# Altium project PPC_notebook_electrical_schematics_v0.6.PrjPcb (part 4 of 10)

## Sheet 12 Proc Pwr2.SchDoc
size 420 x 297 mm
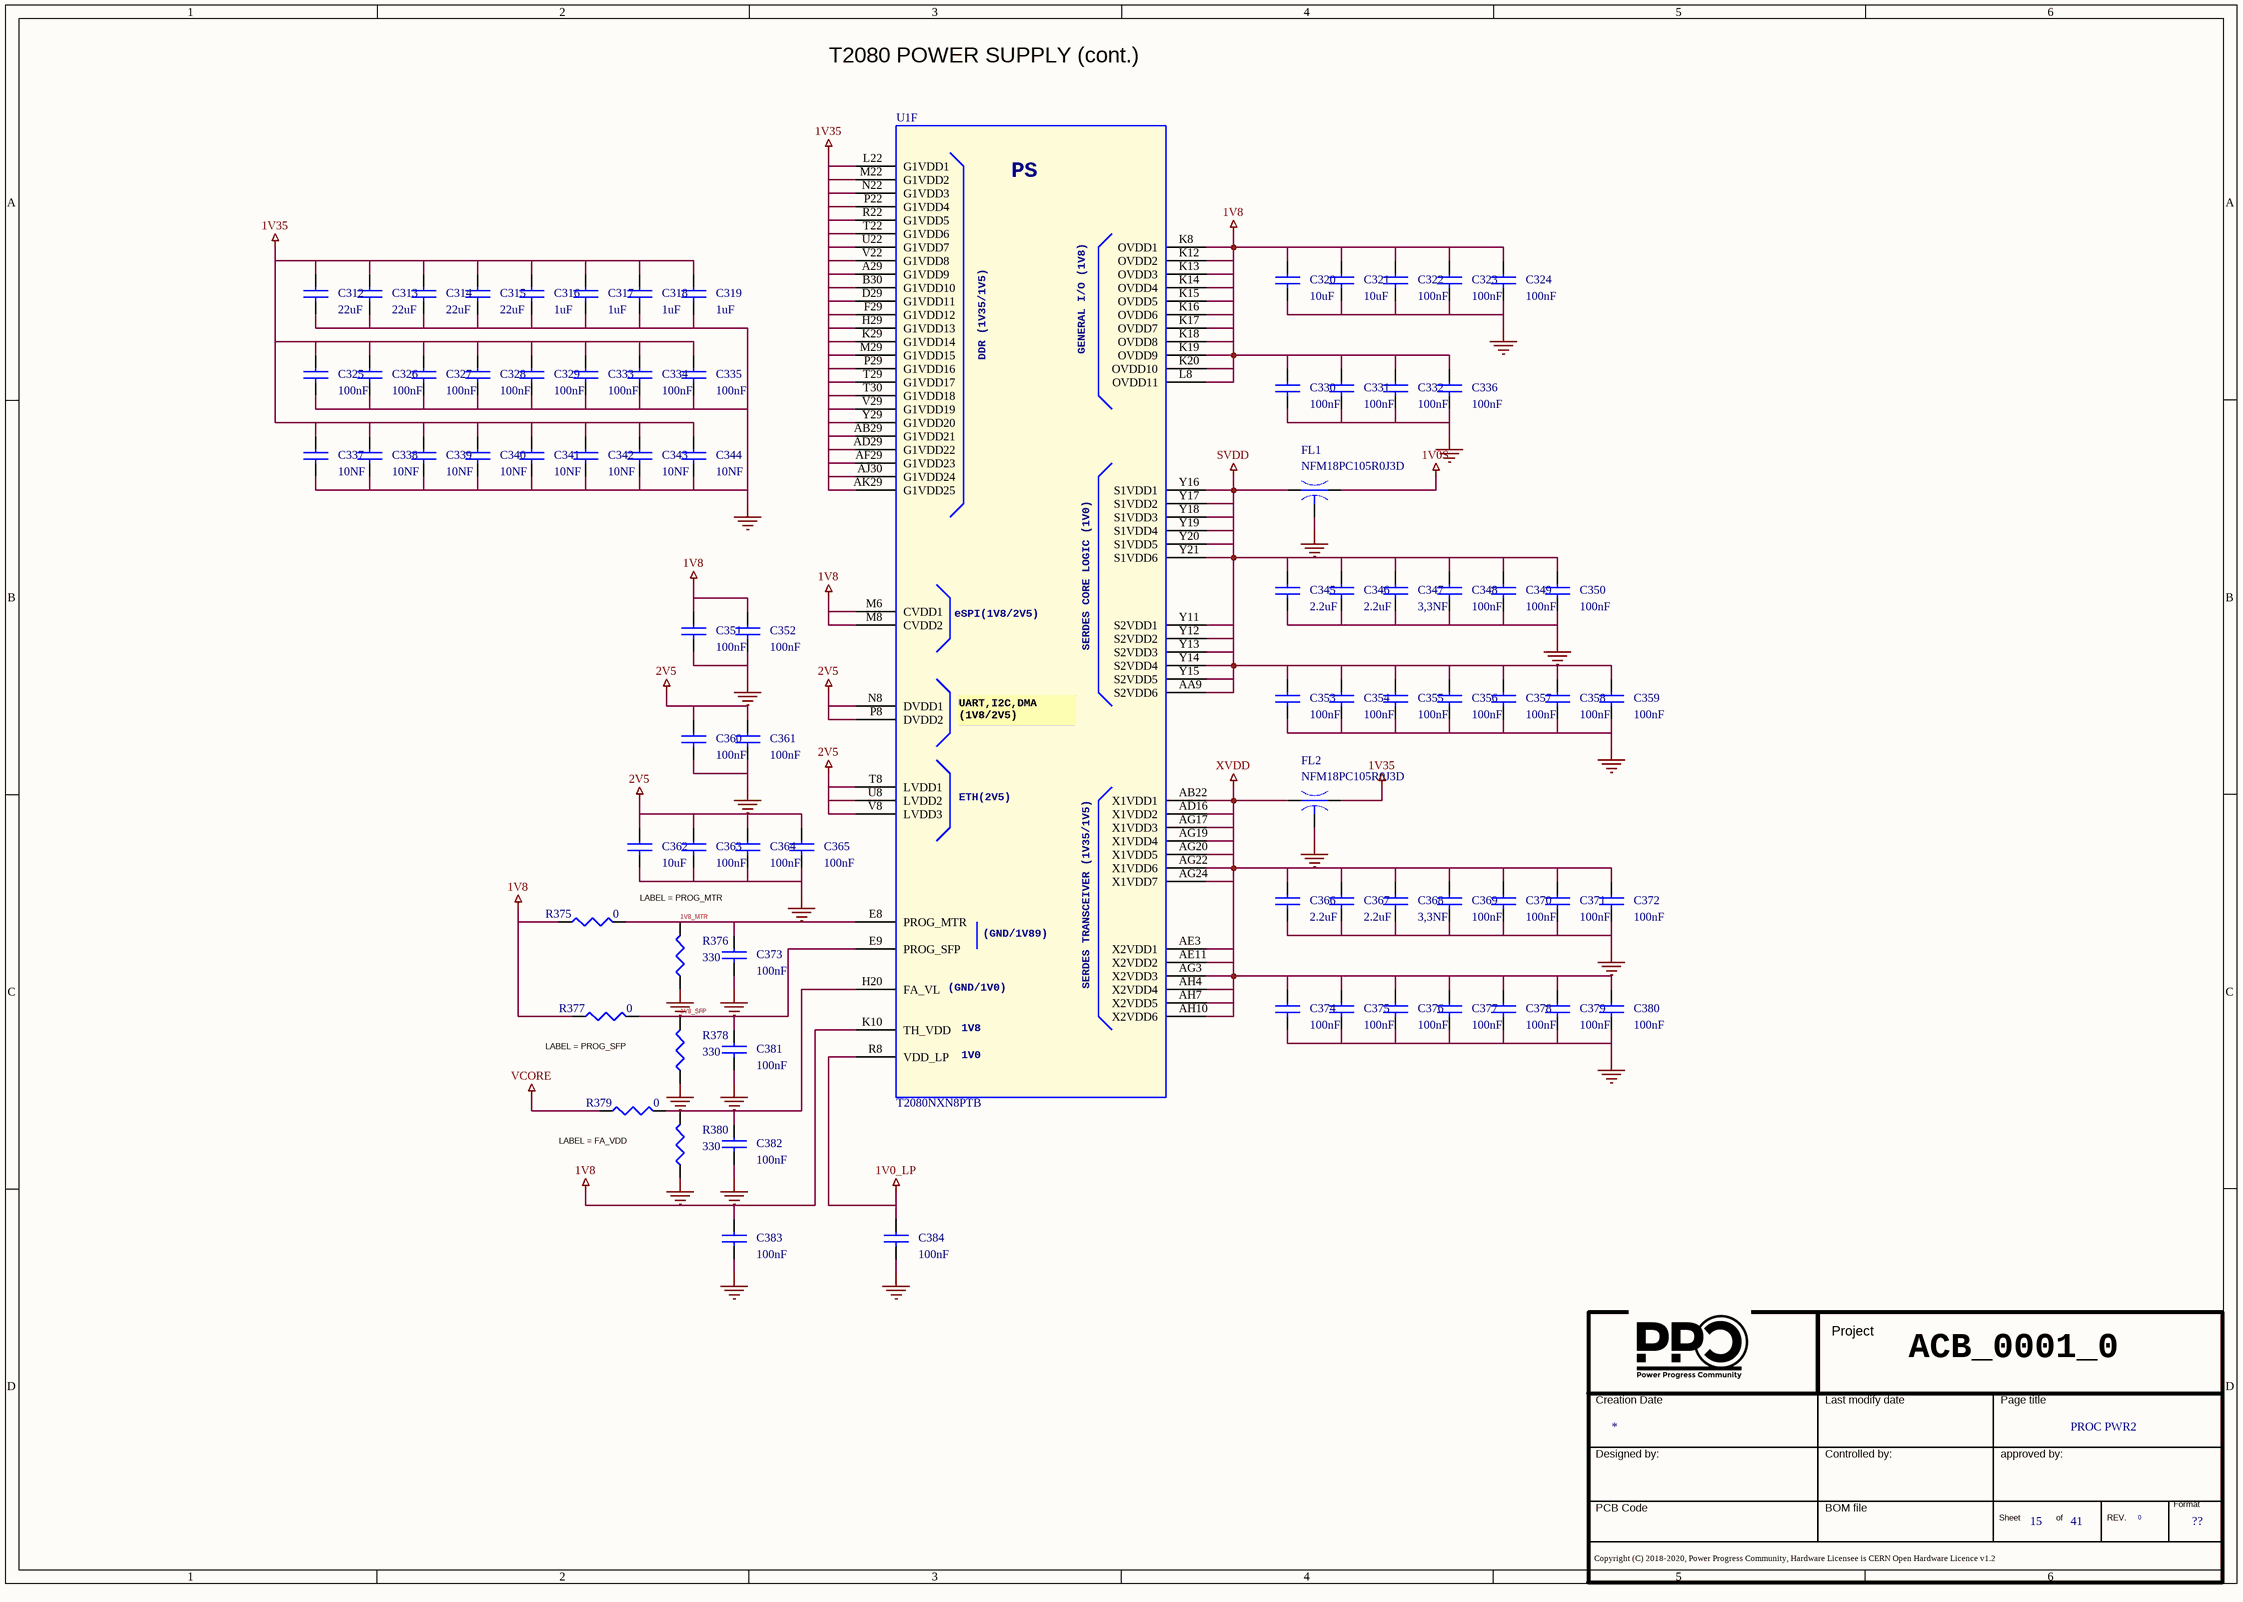
[diagram p24: 12 Proc Pwr2.SchDoc]

### Parts
(Parts that share a designator on the sheet are numbered #1, #2 ... from top to bottom, then left to right.)
*#17  Doc: PROC PWR2  Page Count: 41  Page Number: 15  Page Size: ??  RevCode: 0  (hidden comment: Title_block_PPC)  (graphical)
C312  22uF  [SMD_0805]
C313  22uF  [SMD_0805]
C314  22uF  [SMD_0805]
C315  22uF  [SMD_0805]
C316  1uF  [SMD_0402]
C317  1uF  [SMD_0402]
C318  1uF  [SMD_0402]
C319  1uF  [SMD_0402]
C320  10uF  [SMD_0603]
C321  10uF  [SMD_0603]
C322  100nF  [SMD_0201]
C323  100nF  [SMD_0201]
C324  100nF  [SMD_0201]
C325  100nF  [SMD_0201]
C326  100nF  [SMD_0201]
C327  100nF  [SMD_0201]
C328  100nF  [SMD_0201]
C329  100nF  [SMD_0201]
C330  100nF  [SMD_0201]
C331  100nF  [SMD_0201]
C332  100nF  [SMD_0201]
C333  100nF  [SMD_0201]
C334  100nF  [SMD_0201]
C335  100nF  [SMD_0201]
C336  100nF  [SMD_0201]
C337  10NF  [SMD_0402]
C338  10NF  [SMD_0402]
C339  10NF  [SMD_0402]
C340  10NF  [SMD_0402]
C341  10NF  [SMD_0402]
C342  10NF  [SMD_0402]
C343  10NF  [SMD_0402]
C344  10NF  [SMD_0402]
C345  2.2uF  [SMD_0402]
C346  2.2uF  [SMD_0402]
C347  3,3NF  [SMD_0402]
C348  100nF  [SMD_0201]
C349  100nF  [SMD_0201]
C350  100nF  [SMD_0201]
C351  100nF  [SMD_0201]
C352  100nF  [SMD_0201]
C353  100nF  [SMD_0201]
C354  100nF  [SMD_0201]
C355  100nF  [SMD_0201]
C356  100nF  [SMD_0201]
C357  100nF  [SMD_0201]
C358  100nF  [SMD_0201]
C359  100nF  [SMD_0201]
C360  100nF  [SMD_0201]
C361  100nF  [SMD_0201]
C362  10uF  [SMD_0603]
C363  100nF  [SMD_0201]
C364  100nF  [SMD_0201]
C365  100nF  [SMD_0402]
C366  2.2uF  [SMD_0402]
C367  2.2uF  [SMD_0402]
C368  3,3NF  [SMD_0402]
C369  100nF  [SMD_0201]
C370  100nF  [SMD_0201]
C371  100nF  [SMD_0201]
C372  100nF  [SMD_0201]
C373  100nF  [SMD_0201]
C374  100nF  [SMD_0201]
C375  100nF  [SMD_0201]
C376  100nF  [SMD_0201]
C377  100nF  [SMD_0201]
C378  100nF  [SMD_0201]
C379  100nF  [SMD_0201]
C380  100nF  [SMD_0201]
C381  100nF  [SMD_0201]
C382  100nF  [SMD_0402]
C383  100nF  [SMD_0201]
C384  100nF  [SMD_0201]
FL1  NFM18PC105R0J3D  [SMD_0603]
FL2  NFM18PC105R0J3D  [SMD_0603]
R375  0  [SMD_1206]
R376  330  [SMD_0402]
R377  0  [SMD_1206]
R378  330  [SMD_0402]
R379  0  [SMD_1206]
R380  330  [SMD_0402]
U1  T2080NXN8PTB  [bga]  (part F of 14)

### Nets
1V0_LP: C384.1 U1.R8(VDD_LP)
1V0S: FL1.1(IN)
1V8: C320.1 C321.1 C322.1 C323.1 C324.1 C330.1 C331.1 C332.1 C336.1 C351.1 C352.1 C383.1 R375.1 R377.1 U1.K8(OVDD1) U1.K10(TH_VDD) U1.K12(OVDD2) U1.K13(OVDD3) U1.K14(OVDD4) U1.K15(OVDD5) U1.K16(OVDD6) U1.K17(OVDD7) U1.K18(OVDD8) U1.K19(OVDD9) U1.K20(OVDD10) U1.L8(OVDD11) U1.M6(CVDD1) U1.M8(CVDD2)
1V35: C312.1 C313.1 C314.1 C315.1 C316.1 C317.1 C318.1 C319.1 C325.1 C326.1 C327.1 C328.1 C329.1 C333.1 C334.1 C335.1 C337.1 C338.1 C339.1 C340.1 C341.1 C342.1 C343.1 C344.1 FL2.1(IN) U1.A29(G1VDD9) U1.AB29(G1VDD21) U1.AD29(G1VDD22) U1.AF29(G1VDD23) U1.AJ30(G1VDD24) U1.AK29(G1VDD25) U1.B30(G1VDD10) U1.D29(G1VDD11) U1.F29(G1VDD12) U1.H29(G1VDD13) U1.K29(G1VDD14) U1.L22(G1VDD1) U1.M22(G1VDD2) U1.M29(G1VDD15) U1.N22(G1VDD3) U1.P22(G1VDD4) U1.P29(G1VDD16) U1.R22(G1VDD5) U1.T22(G1VDD6) U1.T29(G1VDD17) U1.T30(G1VDD18) U1.U22(G1VDD7) U1.V22(G1VDD8) U1.V29(G1VDD19) U1.Y29(G1VDD20)
2V5: C360.1 C361.1 C362.1 C363.1 C364.1 C365.1 U1.N8(DVDD1) U1.P8(DVDD2) U1.T8(LVDD1) U1.U8(LVDD2) U1.V8(LVDD3)
GND: C312.2 C313.2 C314.2 C315.2 C316.2 C317.2 C318.2 C319.2 C320.2 C321.2 C322.2 C323.2 C324.2 C325.2 C326.2 C327.2 C328.2 C329.2 C330.2 C331.2 C332.2 C333.2 C334.2 C335.2 C336.2 C337.2 C338.2 C339.2 C340.2 C341.2 C342.2 C343.2 C344.2 C345.2 C346.2 C347.2 C348.2 C349.2 C350.2 C351.2 C352.2 C353.2 C354.2 C355.2 C356.2 C357.2 C358.2 C359.2 C360.2 C361.2 C362.2 C363.2 C364.2 C365.2 C366.2 C367.2 C368.2 C369.2 C370.2 C371.2 C372.2 C373.2 C374.2 C375.2 C376.2 C377.2 C378.2 C379.2 C380.2 C381.2 C382.2 C383.2 C384.2 FL1.2(GND) FL2.2(GND) R376.1 R378.1 R380.1
SVDD: C345.1 C346.1 C347.1 C348.1 C349.1 C350.1 C353.1 C354.1 C355.1 C356.1 C357.1 C358.1 C359.1 FL1.3(OUT) U1.AA9(S2VDD6) U1.Y11(S2VDD1) U1.Y12(S2VDD2) U1.Y13(S2VDD3) U1.Y14(S2VDD4) U1.Y15(S2VDD5) U1.Y16(S1VDD1) U1.Y17(S1VDD2) U1.Y18(S1VDD3) U1.Y19(S1VDD4) U1.Y20(S1VDD5) U1.Y21(S1VDD6)
VCORE: R379.1
XVDD: C366.1 C367.1 C368.1 C369.1 C370.1 C371.1 C372.1 C374.1 C375.1 C376.1 C377.1 C378.1 C379.1 C380.1 FL2.3(OUT) U1.AB22(X1VDD1) U1.AD16(X1VDD2) U1.AE3(X2VDD1) U1.AE11(X2VDD2) U1.AG3(X2VDD3) U1.AG17(X1VDD3) U1.AG19(X1VDD4) U1.AG20(X1VDD5) U1.AG22(X1VDD6) U1.AG24(X1VDD7) U1.AH4(X2VDD4) U1.AH7(X2VDD5) U1.AH10(X2VDD6)
1V8_MTR: C373.1 R375.2 R376.2 U1.E8(PROG_MTR)
1V8_SFP: C381.1 R377.2 R378.2 U1.E9(PROG_SFP)
NetC382_1: C382.1 R379.2 R380.2 U1.H20(FA_VL)

### Notes on the sheet
- T2080 POWER SUPPLY (cont.)
- LABEL = PROG_MTR
- (near R377) LABEL = PROG_SFP
- (near R379) LABEL = FA_VDD
- ACB_0001_0
- (in symbol T2080, part F) PS; GENERAL I/O (1V8); DDR (1V35/1V5); eSPI(1V8/2V5); SERDES CORE LOGIC (1V0); UART,I2C,DMA / (1V8/2V5); ETH(2V5); (GND/1V89); SERDES TRANSCEIVER (1V35/1V5); (GND/1V0); 1V8; 1V0

### Library data of the parts
*#17 = Title_block_PPC: Title: T2080PCIe; Schematic Page Count: 45; Schematic Page Number: 17; Author: MICETEK; Page Create Date: March  8, 1995; Page Title: ?; Page Modify Date: *
C312-C315 = CAP NP_Dup2: as C192-C203 on sheet 11 Proc Pwr1; PCB Footprint: SMD_0805; Part Type: Capacitors\Ceramic\SMD\0805
C316-C319 = CAP NP_Dup2: as C204-C207 on sheet 11 Proc Pwr1; PCB Footprint: SMD_0402; Part Type: Capacitors\Ceramic\SMD\0402
C320 C321 C362 = CAP NP_Dup2: COND.CER.10uF 0603 25V SMD; Manufacturer Part Number 1: CL10A106MA8NRNC; Manufacturer 1: SAMSUNG; Part Number: PASSIVE_124; RSM: RC0603; PCB Footprint: SMD_0603; Part Type: Capacitors\Ceramic\SMD\0603
C322-C336 C348-C361 C363 C364 C369-C381 C383 C384 = CAP NP_Dup2: CAP CER 0.1UF 6.3V 20% X5R 0201; Manufacturer Part Number 1: C0603X5R0J104M030BC; Manufacturer 1: TDK; Part Number: PASSIVE_3; RSM: RC0201; PCB Footprint: SMD_0201; Part Type: Capacitors\Ceramic\SMD\0201
C337-C344 = CAP NP_Dup2: COND.CER. 10NF 16V 0402 X7R SMD; Manufacturer Part Number 1: 0402YC103KAT2A; Manufacturer 1: AVX; Part Number: PASSIVE_28; RSM: RC0402; PCB Footprint: SMD_0402; Part Type: Capacitors\Ceramic\SMD\0402
C345 C346 C366 C367 = CAP NP_Dup2: CAP CER 2.2UF 25V X5R 0402; Manufacturer Part Number 1: GRM155R61E225ME15D; Manufacturer 1: Murata; Part Number: PASSIVE_1448; RSM: RC0402; PCB Footprint: SMD_0402; Part Type: Capacitors\Ceramic\SMD\0402
C347 C368 = CAP NP_Dup2: COND.CER. 3,3NF 50V 0402 X7R SMD; Part Number: PASSIVE_69; RSM: RC0402; PCB Footprint: SMD_0402; Part Type: Capacitors\Ceramic\SMD\0402
C365 C382 = CAP NP_Dup2: as C153-C155 on sheet 10 UART&I2C; PCB Footprint: SMD_0402; Part Type: Capacitors\Ceramic\SMD\0402
FL1 = CAP_EMI_FIL: FILTER LC HIGH FREQ 1UF 0603; Manufacturer 1: Murata; Part Number: PASSIVE_348; RSM: EMI-NFM18-0603; Manufacturer Part Number 1: NFM18PC105R0J3D; Part Type: FILTER\CAP_FIL; PCB Footprint: SMD_0603
FL2 = CAP_EMI_FIL: FILTER LC HIGH FREQ 1UF 0603; Part Number: PASSIVE_348; Manufacturer 1: Murata; RSM: EMI-NFM18-0603; Part Type: FILTER\CAP_FIL; Manufacturer Part Number 1: NFM18PC105R0J3D; PCB Footprint: SMD_0603
R375 R377 R379 = R_Dup5: RESIS. 0R 1/4W 1206 SMD E96; Manufacturer Part Number 1: CR32000ZL; Manufacturer 1: ASJ; Part Number: PASSIVE_1266; RSM: RC1206; Part Type: Resistors\Fixed\SMD\1206\5%; PCB Footprint: SMD_1206
R376 R378 R380 = R_Dup5: RESIS.CHIP 330R 5% 0402 SMD; Part Number: PASSIVE_854; Manufacturer 1: ROYAL OHM; RSM: RC0402; Part Type: Resistors\Fixed\SMD\0402\5%; Manufacturer Part Number 1: RESIS.CHIP 330R 5% 0402 SMD; PCB Footprint: SMD_0402
U1 = T2080: QRIQ MPU 1.87GT/s DDR3/3L 4x10GE; Part Number: MICROPROCESSOR_65; Manufacturer 1: NXP; Vendor: Freescale; PCB Footprint: BGA896; RSM: PBGA896-0_8MM-25X25; MPN: T2080; TYPE: IC; Part Type: 32 BIT; Manufacturer Part Number 1: T2080NXN8PTB; Distributor 1: MOUSER(841-T2080NXN8PTB)

## Sheet 13 Proc Gnd.SchDoc
size 420 x 297 mm
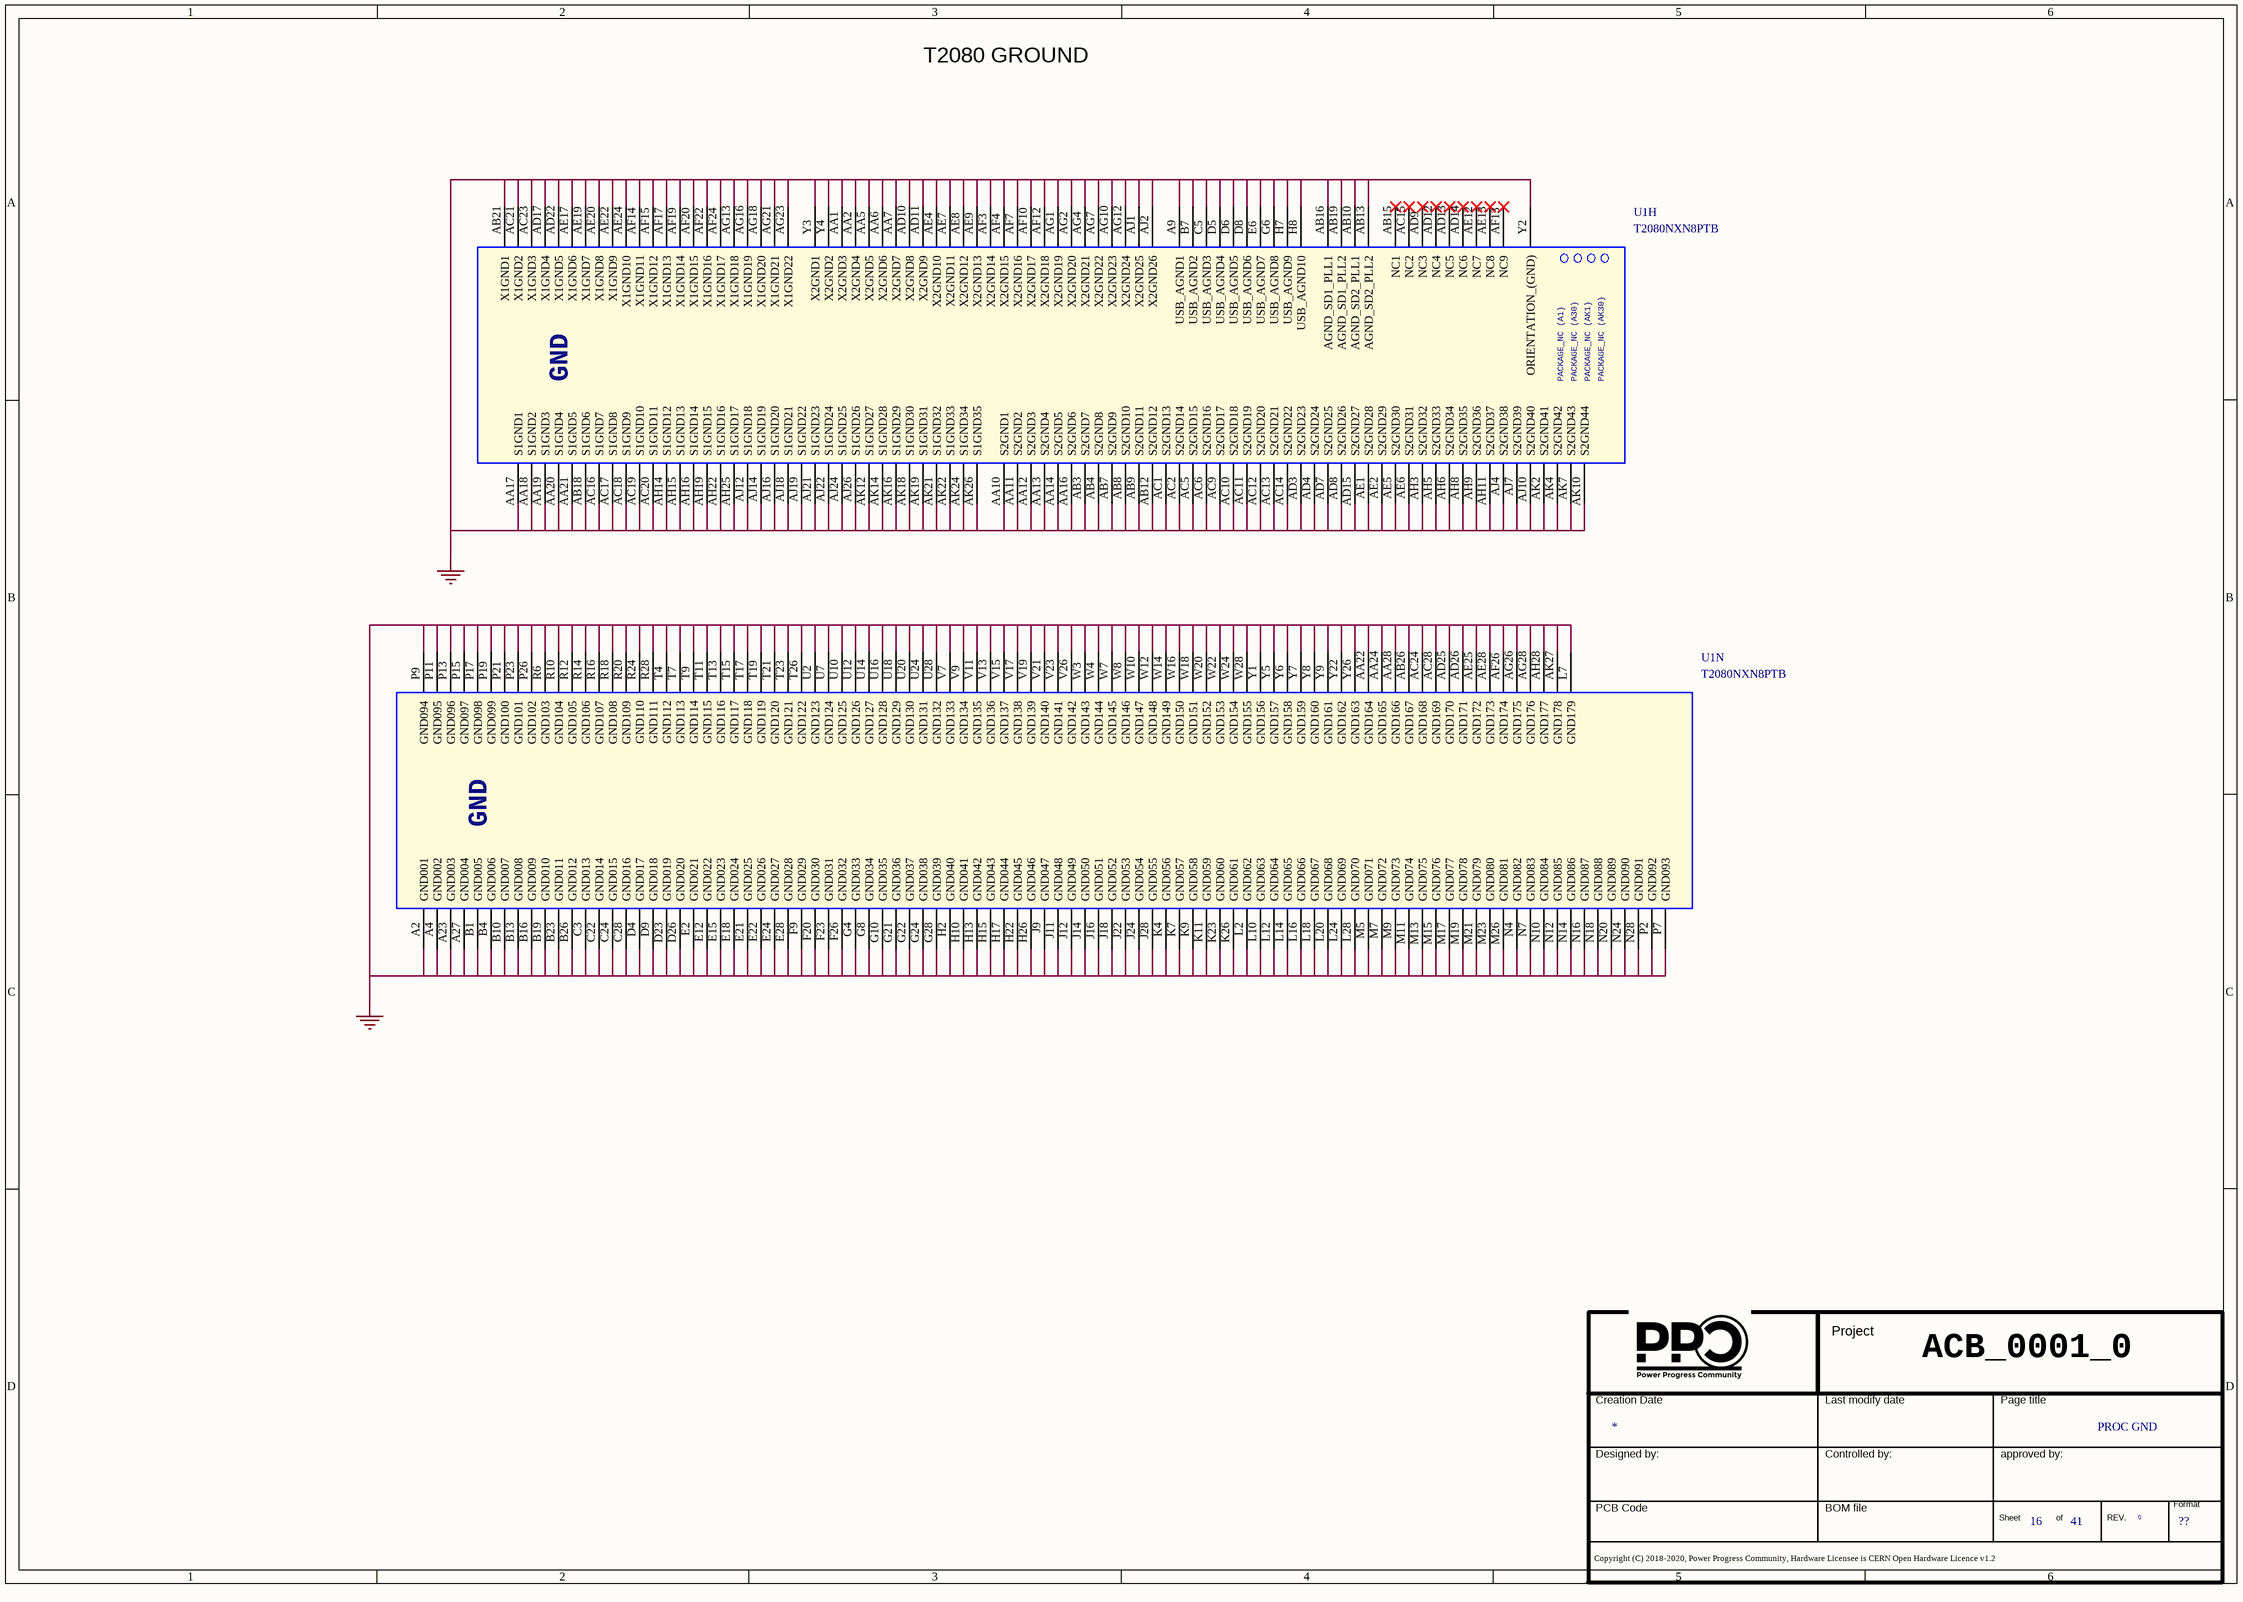
[diagram p25: 13 Proc Gnd.SchDoc]

### Parts
(Parts that share a designator on the sheet are numbered #1, #2 ... from top to bottom, then left to right.)
*#18  Doc: PROC GND  Page Count: 41  Page Number: 16  Page Size: ??  RevCode: 0  (hidden comment: Title_block_PPC)  (graphical)
U1  T2080NXN8PTB  [bga]  (parts H,N of 14)

### Nets
GND: U1.A2(GND001) U1.A4(GND002) U1.A9(USB_AGND1) U1.A23(GND003) U1.A27(GND004) U1.AA1(X2GND3) U1.AA2(X2GND4) U1.AA5(X2GND5) U1.AA6(X2GND6) U1.AA7(X2GND7) U1.AA10(S2GND1) U1.AA11(S2GND2) U1.AA12(S2GND3) U1.AA13(S2GND4) U1.AA14(S2GND5) U1.AA16(S2GND6) U1.AA17(S1GND1) U1.AA18(S1GND2) U1.AA19(S1GND3) U1.AA20(S1GND4) U1.AA21(S1GND5) U1.AA22(GND164) U1.AA24(GND165) U1.AA28(GND166) U1.AB3(S2GND7) U1.AB4(S2GND8) U1.AB7(S2GND9) U1.AB8(S2GND10) U1.AB9(S2GND11) U1.AB10(AGND_SD2_PLL1) U1.AB12(S2GND12) U1.AB13(AGND_SD2_PLL2) U1.AB16(AGND_SD1_PLL1) U1.AB18(S1GND6) U1.AB19(AGND_SD1_PLL2) U1.AB21(X1GND1) U1.AB26(GND167) U1.AC1(S2GND13) U1.AC2(S2GND14) U1.AC5(S2GND15) U1.AC6(S2GND16) U1.AC9(S2GND17) U1.AC10(S2GND18) U1.AC11(S2GND19) U1.AC12(S2GND20) U1.AC13(S2GND21) U1.AC14(S2GND22) U1.AC16(S1GND7) U1.AC17(S1GND8) U1.AC18(S1GND9) U1.AC19(S1GND10) U1.AC20(S1GND11) U1.AC21(X1GND2) U1.AC23(X1GND3) U1.AC24(GND168) U1.AC28(GND169) U1.AD3(S2GND23) U1.AD4(S2GND24) U1.AD7(S2GND25) U1.AD8(S2GND26) U1.AD10(X2GND8) U1.AD11(X2GND9) U1.AD15(S2GND27) U1.AD17(X1GND4) U1.AD22(X1GND5) U1.AD25(GND170) U1.AD26(GND171) U1.AE1(S2GND28) U1.AE2(S2GND29) U1.AE4(X2GND10) U1.AE5(S2GND30) U1.AE6(S2GND31) U1.AE7(X2GND11) U1.AE8(X2GND12) U1.AE9(X2GND13) U1.AE17(X1GND6) U1.AE19(X1GND7) U1.AE20(X1GND8) U1.AE22(X1GND9) U1.AE24(X1GND10) U1.AE25(GND172) U1.AE28(GND173) U1.AF3(X2GND14) U1.AF4(X2GND15) U1.AF7(X2GND16) U1.AF10(X2GND17) U1.AF12(X2GND18) U1.AF14(X1GND11) U1.AF15(X1GND12) U1.AF17(X1GND13) U1.AF19(X1GND14) U1.AF20(X1GND15) U1.AF22(X1GND16) U1.AF24(X1GND17) U1.AF26(GND174) U1.AG1(X2GND19) U1.AG2(X2GND20) U1.AG4(X2GND21) U1.AG7(X2GND22) U1.AG10(X2GND23) U1.AG12(X2GND24) U1.AG13(X1GND18) U1.AG16(X1GND19) U1.AG18(X1GND20) U1.AG21(X1GND21) U1.AG23(X1GND22) U1.AG26(GND175) U1.AG28(GND176) U1.AH3(S2GND32) U1.AH5(S2GND33) U1.AH6(S2GND34) U1.AH8(S2GND35) U1.AH9(S2GND36) U1.AH11(S2GND37) U1.AH14(S1GND12) U1.AH15(S1GND13) U1.AH16(S1GND14) U1.AH19(S1GND15) U1.AH22(S1GND16) U1.AH25(S1GND17) U1.AH28(GND177) U1.AJ1(X2GND25) U1.AJ2(X2GND26) U1.AJ4(S2GND38) U1.AJ7(S2GND39) U1.AJ10(S2GND40) U1.AJ12(S1GND18) U1.AJ14(S1GND19) U1.AJ16(S1GND20) U1.AJ18(S1GND21) U1.AJ19(S1GND22) U1.AJ21(S1GND23) U1.AJ22(S1GND24) U1.AJ24(S1GND25) U1.AJ26(S1GND26) U1.AK2(S2GND41) U1.AK4(S2GND42) U1.AK7(S2GND43) U1.AK10(S2GND44) U1.AK12(S1GND27) U1.AK14(S1GND28) U1.AK16(S1GND29) U1.AK18(S1GND30) U1.AK19(S1GND31) U1.AK21(S1GND32) U1.AK22(S1GND33) U1.AK24(S1GND34) U1.AK26(S1GND35) U1.AK27(GND178) U1.B1(GND005) U1.B4(GND006) U1.B7(USB_AGND2) U1.B10(GND007) U1.B13(GND008) U1.B16(GND009) U1.B19(GND010) U1.B23(GND011) U1.B26(GND012) U1.C3(GND013) U1.C5(USB_AGND3) U1.C22(GND014) U1.C24(GND015) U1.C28(GND016) U1.D4(GND017) U1.D5(USB_AGND4) U1.D6(USB_AGND5) U1.D8(USB_AGND6) U1.D9(GND018) U1.D23(GND019) U1.D26(GND020) U1.E2(GND021) U1.E6(USB_AGND7) U1.E12(GND022) U1.E15(GND023) U1.E18(GND024) U1.E21(GND025) U1.E22(GND026) U1.E24(GND027) U1.E28(GND028) U1.F9(GND029) U1.F20(GND030) U1.F23(GND031) U1.F26(GND032) U1.G4(GND033) U1.G6(USB_AGND8) U1.G8(GND034) U1.G10(GND035) U1.G21(GND036) U1.G22(GND037) U1.G24(GND038) U1.G28(GND039) U1.H2(GND040) U1.H7(USB_AGND9) U1.H8(USB_AGND10) U1.H10(GND041) U1.H13(GND042) U1.H15(GND043) U1.H17(GND044) U1.H22(GND045) U1.H26(GND046) U1.J9(GND047) U1.J11(GND048) U1.J12(GND049) U1.J14(GND050) U1.J16(GND051) U1.J18(GND052) U1.J22(GND053) U1.J24(GND054) U1.J28(GND055) U1.K4(GND056) U1.K7(GND057) U1.K9(GND058) U1.K11(GND059) U1.K23(GND060) U1.K26(GND061) U1.L2(GND062) U1.L7(GND179) U1.L10(GND063) U1.L12(GND064) U1.L14(GND065) U1.L16(GND066) U1.L18(GND067) U1.L20(GND068) U1.L24(GND069) U1.L28(GND070) U1.M5(GND071) U1.M7(GND072) U1.M9(GND073) U1.M11(GND074) U1.M13(GND075) U1.M15(GND076) U1.M17(GND077) U1.M19(GND078) U1.M21(GND079) U1.M23(GND080) U1.M26(GND081) U1.N4(GND082) U1.N7(GND083) U1.N10(GND084) U1.N12(GND085) U1.N14(GND086) U1.N16(GND087) U1.N18(GND088) U1.N20(GND089) U1.N24(GND090) U1.N28(GND091) U1.P2(GND092) U1.P7(GND093) U1.P9(GND094) U1.P11(GND095) U1.P13(GND096) U1.P15(GND097) U1.P17(GND098) U1.P19(GND099) U1.P21(GND100) U1.P23(GND101) U1.P26(GND102) U1.R6(GND103) U1.R10(GND104) U1.R12(GND105) U1.R14(GND106) U1.R16(GND107) U1.R18(GND108) U1.R20(GND109) U1.R24(GND110) U1.R28(GND111) U1.T4(GND112) U1.T7(GND113) U1.T9(GND114) U1.T11(GND115) U1.T13(GND116) U1.T15(GND117) U1.T17(GND118) U1.T19(GND119) U1.T21(GND120) U1.T23(GND121) U1.T26(GND122) U1.U2(GND123) U1.U7(GND124) U1.U10(GND125) U1.U12(GND126) U1.U14(GND127) U1.U16(GND128) U1.U18(GND129) U1.U20(GND130) U1.U24(GND131) U1.U28(GND132) U1.V7(GND133) U1.V9(GND134) U1.V11(GND135) U1.V13(GND136) U1.V15(GND137) U1.V17(GND138) U1.V19(GND139) U1.V21(GND140) U1.V23(GND141) U1.V26(GND142) U1.W3(GND143) U1.W4(GND144) U1.W7(GND145) U1.W8(GND146) U1.W10(GND147) U1.W12(GND148) U1.W14(GND149) U1.W16(GND150) U1.W18(GND151) U1.W20(GND152) U1.W22(GND153) U1.W24(GND154) U1.W28(GND155) U1.Y1(GND156) U1.Y2(ORIENTATION_(GND)) U1.Y3(X2GND1) U1.Y4(X2GND2) U1.Y5(GND157) U1.Y6(GND158) U1.Y7(GND159) U1.Y8(GND160) U1.Y9(GND161) U1.Y22(GND162) U1.Y26(GND163)

Not connected (* = marked no-connect by the designer): U1 AB15(NC1)* AC15(NC2)* AD9(NC3)* AD12(NC4)* AD13(NC5)* AD14(NC6)* AE12(NC7)* AE13(NC8)* AF13(NC9)*

### Notes on the sheet
- T2080 GROUND
- ACB_0001_0
- (in symbol T2080, part H) GND; PACKAGE_NC (A1); PACKAGE_NC (A30); PACKAGE_NC (AK1); PACKAGE_NC (AK30)
- (in symbol T2080, part N) GND

### Library data of the parts
*#18 = Title_block_PPC: Title: T2080PCIe; Schematic Page Count: 45; Schematic Page Number: 18; Author: MICETEK; Page Create Date: March  8, 1995; Page Title: ?; Page Modify Date: *
U1 = T2080: QRIQ MPU 1.87GT/s DDR3/3L 4x10GE; Manufacturer 1: NXP; Part Number: MICROPROCESSOR_65; PCB Footprint: BGA896; Vendor: Freescale; RSM: PBGA896-0_8MM-25X25; Distributor 1: MOUSER(841-T2080NXN8PTB); Manufacturer Part Number 1: T2080NXN8PTB; Part Type: 32 BIT; MPN: T2080; TYPE: IC

## Sheet 14 EC1 PHY.SchDoc
size 594 x 420 mm
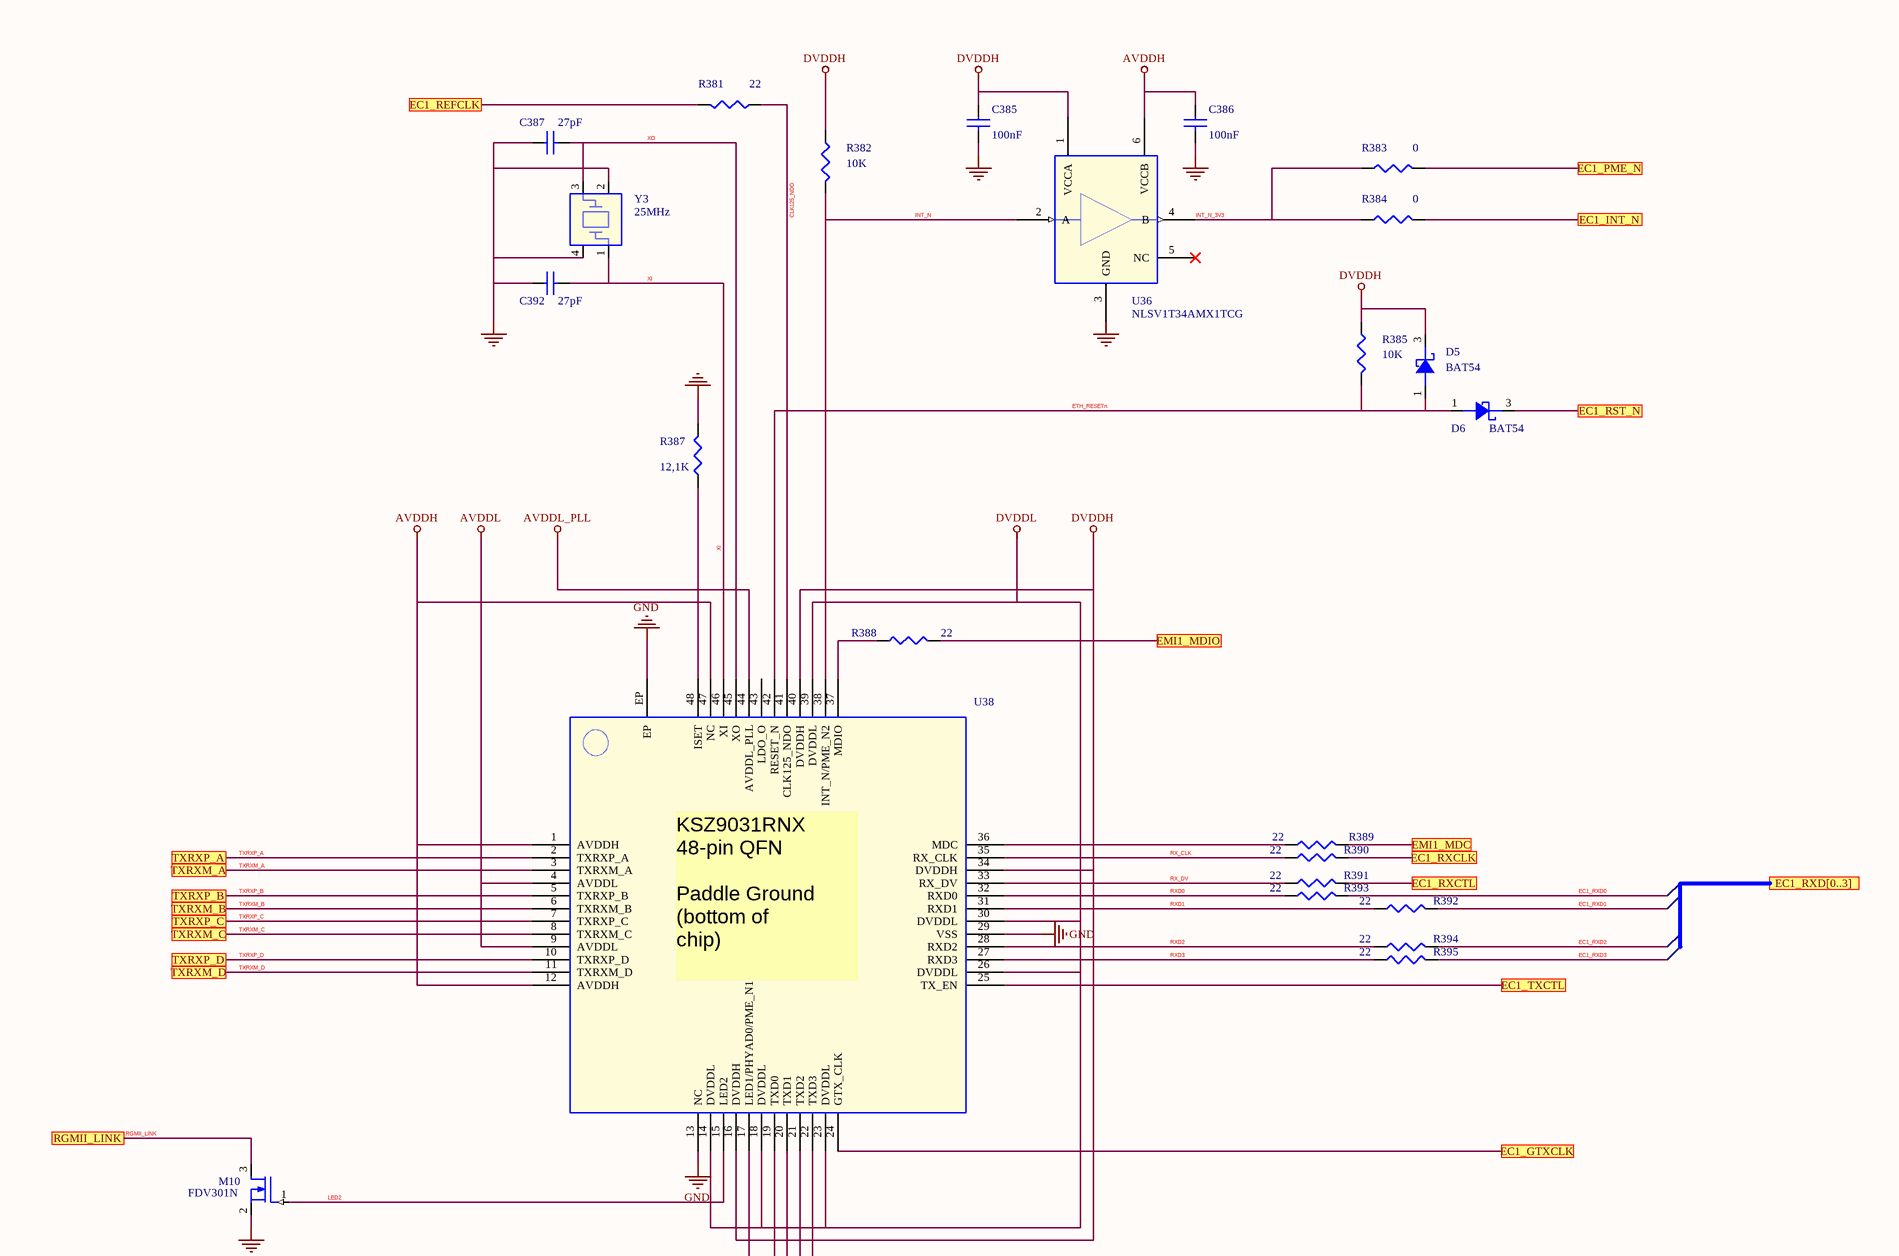
[diagram p26: 14 EC1 PHY.SchDoc, top left]
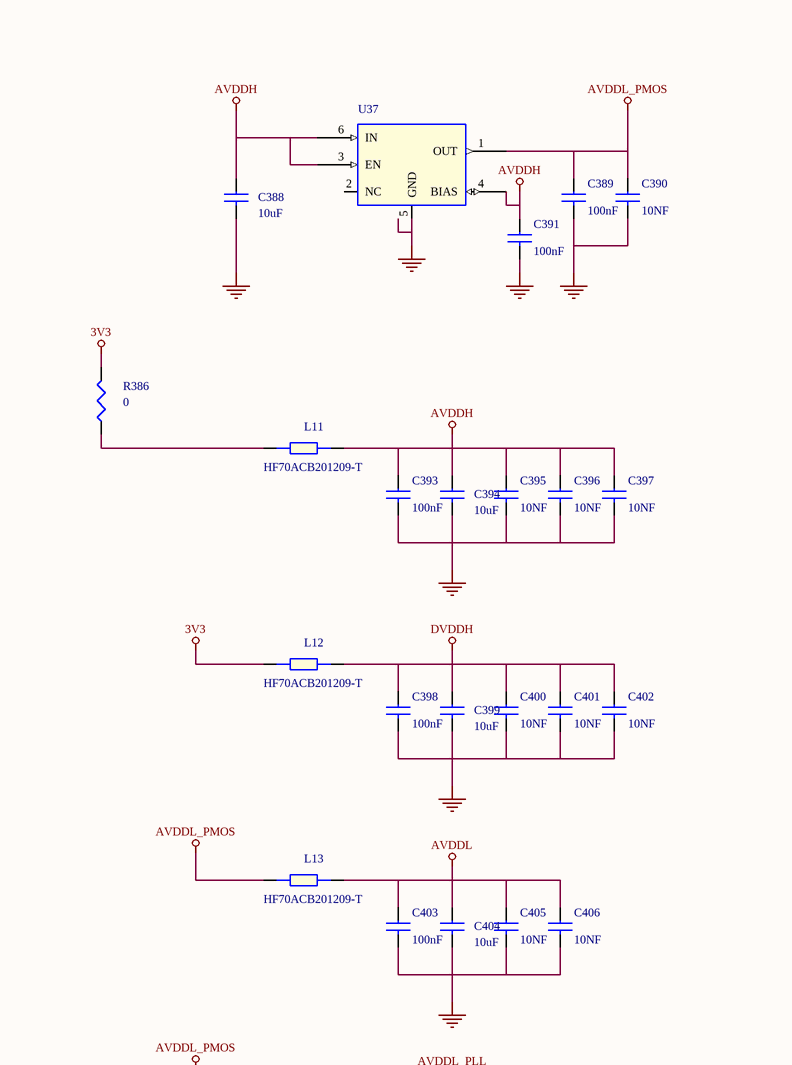
[diagram p27: 14 EC1 PHY.SchDoc, top right]
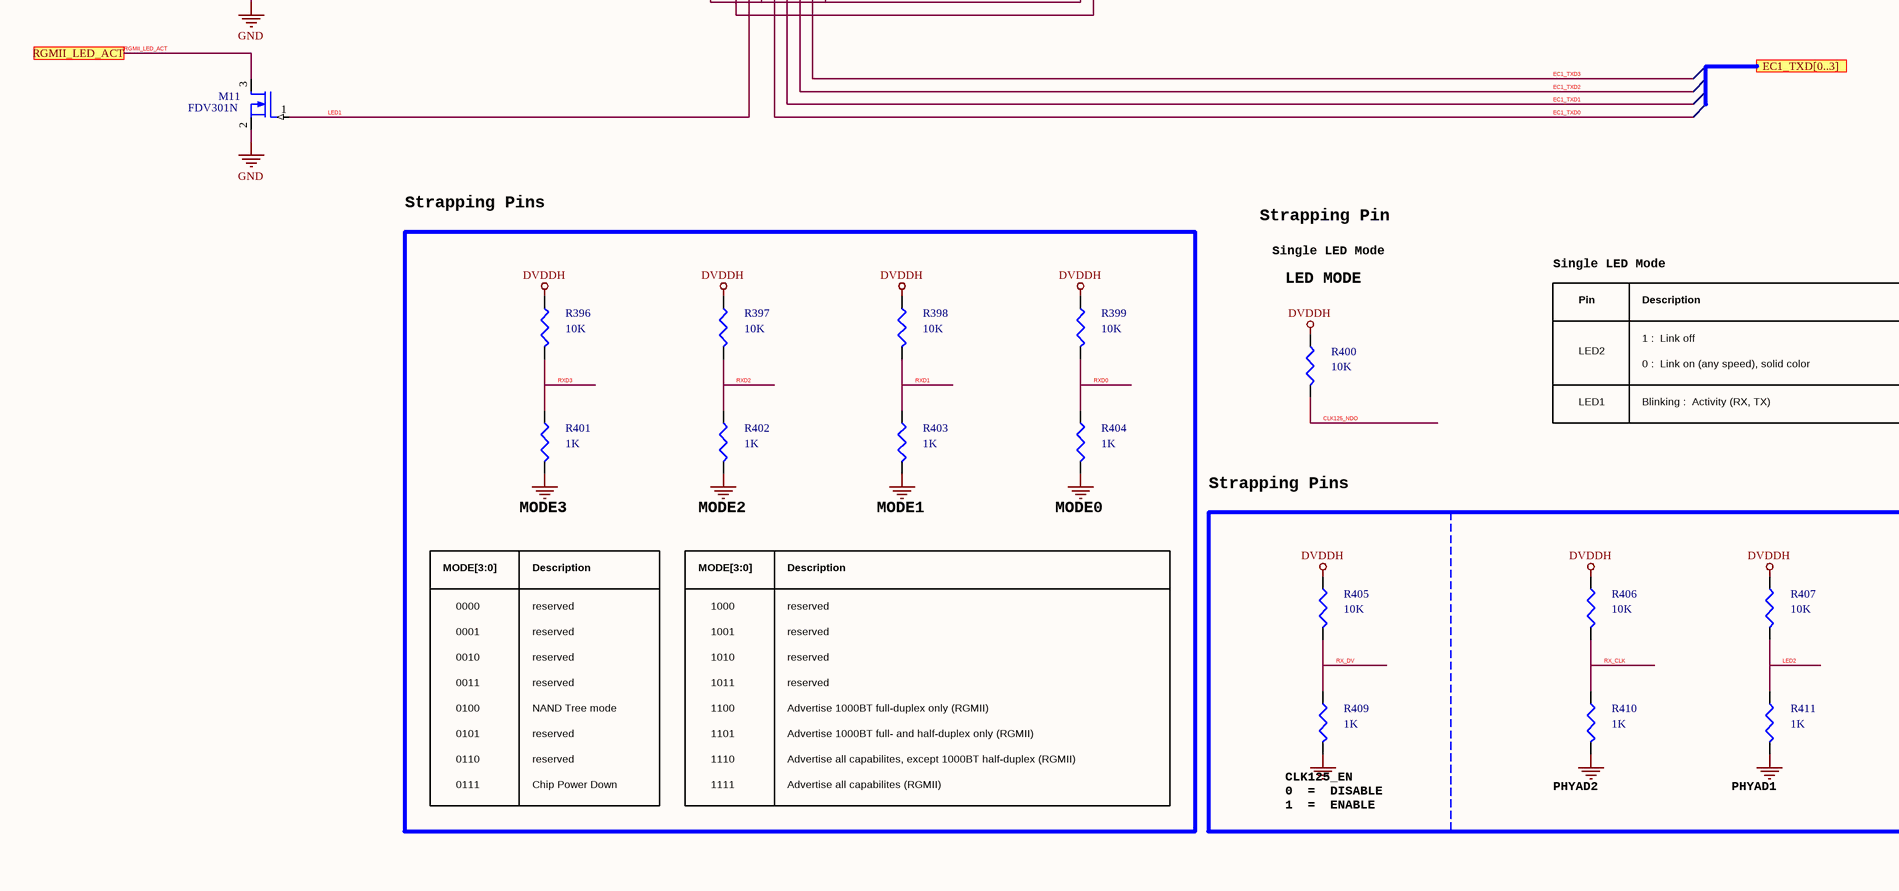
[diagram p28: 14 EC1 PHY.SchDoc, bottom left]
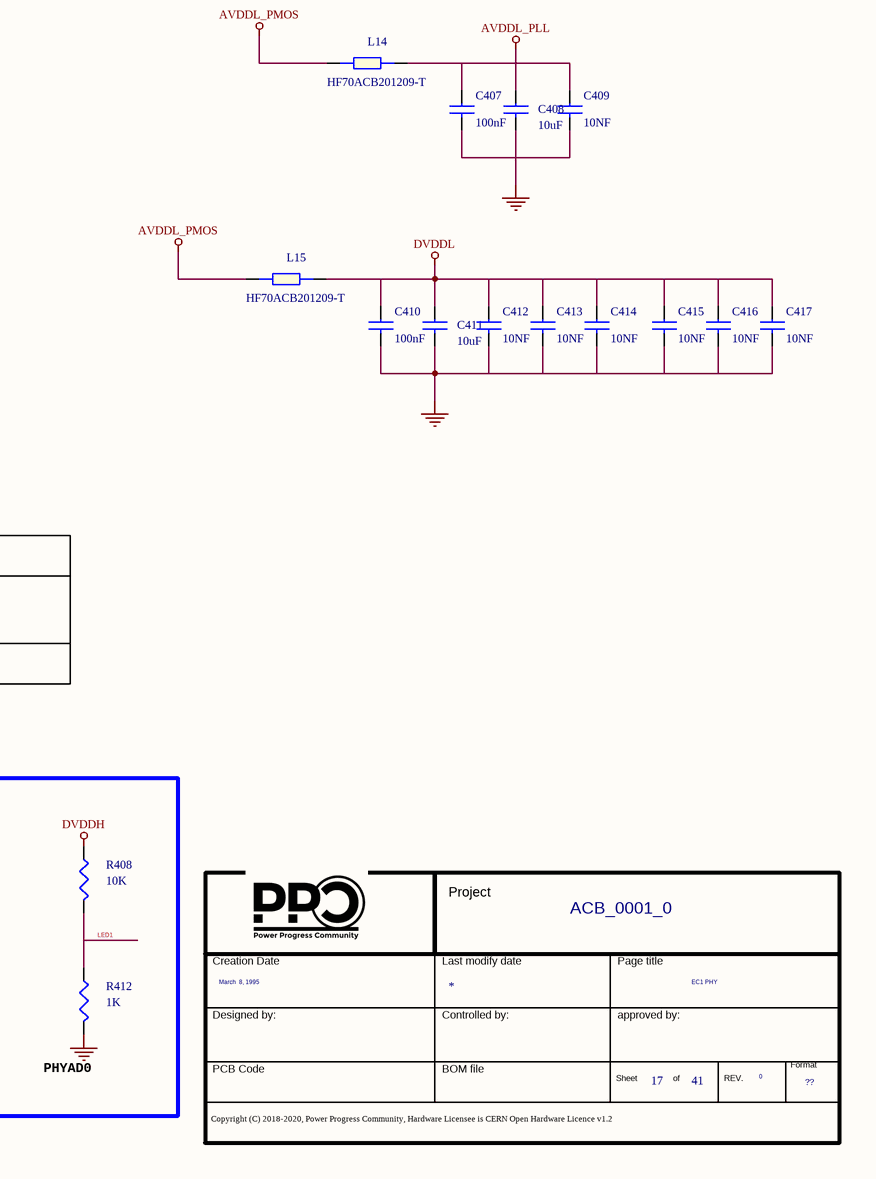
[diagram p29: 14 EC1 PHY.SchDoc, bottom right]

### Parts
(Parts that share a designator on the sheet are numbered #1, #2 ... from top to bottom, then left to right.)
*#19  Page Count: 41  Page Create Date: March  8, 1995  Page Number: 17  Page Size: ??  Page Title: EC1 PHY  RevCode: 0  Title: ACB_0001_0  (hidden comment: Title_block_PPC)  (graphical)
C385  100nF  [SMD_0402]
C386  100nF  [SMD_0402]
C387  27pF  [SMD_0402]
C388  10uF  [SMD_0603]
C389  100nF  [SMD_0402]
C390  10NF  [SMD_0402]
C391  100nF  [SMD_0402]
C392  27pF  [SMD_0402]
C393  100nF  [SMD_0402]
C394  10uF  [SMD_0603]
C395  10NF  [SMD_0402]
C396  10NF  [SMD_0402]
C397  10NF  [SMD_0402]
C398  100nF  [SMD_0402]
C399  10uF  [SMD_0603]
C400  10NF  [SMD_0402]
C401  10NF  [SMD_0402]
C402  10NF  [SMD_0402]
C403  100nF  [SMD_0402]
C404  10uF  [SMD_0603]
C405  10NF  [SMD_0402]
C406  10NF  [SMD_0402]
C407  100nF  [SMD_0402]
C408  10uF  [SMD_0603]
C409  10NF  [SMD_0402]
C410  100nF  [SMD_0402]
C411  10uF  [SMD_0603]
C412  10NF  [SMD_0402]
C413  10NF  [SMD_0402]
C414  10NF  [SMD_0402]
C415  10NF  [SMD_0402]
C416  10NF  [SMD_0402]
C417  10NF  [SMD_0402]
D5  BAT54  [SOT-23]
D6  BAT54  [SOT-23]
L11  HF70ACB201209-T  [SMD_0805]
L12  HF70ACB201209-T  [SMD_0805]
L13  HF70ACB201209-T  [SMD_0805]
L14  HF70ACB201209-T  [SMD_0805]
L15  HF70ACB201209-T  [SMD_0805]
M10  FDV301N  [sot23]
M11  FDV301N  [sot23]
R381  22  [SMD_0402]
R382  10K  [SMD_0402]
R383  0  [SMD_0402]
R384  0  [SMD_0402]
R385  10K  [SMD_0402]
R386  0  [SMD_0402]
R387  12,1K  [SMD_0402]
R388  22  [SMD_0402]
R389  22  [SMD_0402]
R390  22  [SMD_0402]
R391  22  [SMD_0402]
R392  22  [SMD_0402]
R393  22  [SMD_0402]
R394  22  [SMD_0402]
R395  22  [SMD_0402]
R396  10K  [SMD_0402]
R397  10K  [SMD_0402]
R398  10K  [SMD_0402]
R399  10K  [SMD_0402]
R400  10K  [SMD_0402]
R401  1K  [SMD_0402]
R402  1K  [SMD_0402]
R403  1K  [SMD_0402]
R404  1K  [SMD_0402]
R405  10K  [SMD_0402]
R406  10K  [SMD_0402]
R407  10K  [SMD_0402]
R408  10K  [SMD_0402]
R409  1K  [SMD_0402]
R410  1K  [SMD_0402]
R411  1K  [SMD_0402]
R412  1K  [SMD_0402]
U36  NLSV1T34AMX1TCG  [6-XFLGA]
U37  TPS72012DRVT  [6SON]  (value not drawn)
U38  KSZ9031RNXCA  [QFN48]  (value not drawn)
Y3  25MHz  [SMD_5.0x3.2]

### Ports
EC1_GTXCLK, EC1_INT_N, EC1_PME_N, EC1_REFCLK, EC1_RST_N, EC1_RXCLK, EC1_RXCTL, EC1_RXD[0..3], EC1_TXCTL, EC1_TXD[0..3], EMI1_MDC, EMI1_MDIO, RGMII_LED_ACT, RGMII_LINK, TXRXM_A, TXRXM_B, TXRXM_C, TXRXM_D, TXRXP_A, TXRXP_B, TXRXP_C, TXRXP_D

### Nets
3V3: L12.1 R386.1
AVDDH: C386.1 C388.1 C391.1 C393.1 C394.1 C395.1 C396.1 C397.1 L11.2 U36.6(VCCB) U37.3(EN) U37.4(BIAS) U37.6(IN) U38.1(AVDDH) U38.12(AVDDH) U38.47(NC)
AVDDL: C403.1 C404.1 C405.1 C406.1 L13.2 U38.4(AVDDL) U38.9(AVDDL)
AVDDL_PLL: C407.1 C408.1 C409.1 L14.2 U38.44(AVDDL_PLL)
AVDDL_PMOS: C389.1 C390.1 L13.1 L14.1 L15.1 U37.1(OUT)
DVDDH: C385.1 C398.1 C399.1 C400.1 C401.1 C402.1 D5.3(CATHODE) L12.2 R382.1 R385.1 R396.1 R397.1 R398.1 R399.1 R400.1 R405.1 R406.1 R407.1 R408.1 U36.1(VCCA) U38.16(DVDDH) U38.34(DVDDH) U38.40(DVDDH)
DVDDL: C410.1 C411.1 C412.1 C413.1 C414.1 C415.1 C416.1 C417.1 L15.2 U38.14(DVDDL) U38.18(DVDDL) U38.23(DVDDL) U38.26(DVDDL) U38.30(DVDDL) U38.39(DVDDL)
GND: C385.2 C386.2 C387.1 C388.2 C389.2 C390.2 C391.2 C392.1 C393.2 C394.2 C395.2 C396.2 C397.2 C398.2 C399.2 C400.2 C401.2 C402.2 C403.2 C404.2 C405.2 C406.2 C407.2 C408.2 C409.2 C410.2 C411.2 C412.2 C413.2 C414.2 C415.2 C416.2 C417.2 M10.2(SOURCE) M11.2(SOURCE) R387.1 R401.2 R402.2 R403.2 R404.2 R409.2 R410.2 R411.2 R412.2 U36.3(GND) U37.5(GND) U38.13(NC) U38.29(VSS) U38.EP Y3.2 Y3.4
CLK125_NDO: R381.1 R400.2 U38.41(CLK125_NDO)
EC1_RXD0: R393.1
EC1_RXD1: R392.1
EC1_RXD2: R394.1
EC1_RXD3: R395.1
EC1_TXD0: U38.19(TXD0)
EC1_TXD1: U38.20(TXD1)
EC1_TXD2: U38.21(TXD2)
EC1_TXD3: U38.22(TXD3)
ETH_RESETn: D5.1(ANODE) D6.1(ANODE) R385.2 U38.42(RESET_N)
INT_N: R382.2 U36.2(A) U38.38(INT_N/PME_N2)
INT_N_3V3: R383.2 R384.2 U36.4(B)
LED1: M11.1(GATE) R408.2 R412.1 U38.17(LED1/PHYAD0/PME_N1)
LED2: M10.1(GATE) R407.2 R411.1 U38.15(LED2)
RGMII_LED_ACT: M11.3(DRAIN) ; port RGMII_LED_ACT
RGMII_LINK: M10.3(DRAIN) ; port RGMII_LINK
RX_CLK: R390.2 R406.2 R410.1 U38.35(RX_CLK)
RX_DV: R391.2 R405.2 R409.1 U38.33(RX_DV)
RXD0: R393.2 R399.2 R404.1 U38.32(RXD0)
RXD1: R392.2 R398.2 R403.1 U38.31(RXD1)
RXD2: R394.2 R397.2 R402.1 U38.28(RXD2)
RXD3: R395.2 R396.2 R401.1 U38.27(RXD3)
TXRXM_A: U38.3(TXRXM_A) ; port TXRXM_A
TXRXM_B: U38.6(TXRXM_B) ; port TXRXM_B
TXRXM_C: U38.8(TXRXM_C) ; port TXRXM_C
TXRXM_D: U38.11(TXRXM_D) ; port TXRXM_D
TXRXP_A: U38.2(TXRXP_A) ; port TXRXP_A
TXRXP_B: U38.5(TXRXP_B) ; port TXRXP_B
TXRXP_C: U38.7(TXRXP_C) ; port TXRXP_C
TXRXP_D: U38.10(TXRXP_D) ; port TXRXP_D
XI: C392.2 U38.46(XI) Y3.1
XO: C387.2 U38.45(XO) Y3.3
NetD6_3: D6.3(CATHODE) ; port EC1_RST_N
NetL11_1: L11.1 R386.2
NetR89_1: R383.1 ; port EC1_PME_N
NetR90_1: R384.1 ; port EC1_INT_N
NetR137_2: U38.25(TX_EN) ; port EC1_TXCTL
NetR138_2: U38.24(GTX_CLK) ; port EC1_GTXCLK
NetR156_2: R389.1 ; port EMI1_MDC
NetR157_2: R388.1 ; port EMI1_MDIO
NetR381_2: R381.2 ; port EC1_REFCLK
NetR387_2: R387.2 U38.48(ISET)
NetR388_2: R388.2 U38.37(MDIO)
NetR389_2: R389.2 U38.36(MDC)
NetR390_1: R390.1 ; port EC1_RXCLK
NetR391_1: R391.1 ; port EC1_RXCTL

Not connected (* = marked no-connect by the designer): U36 5(NC)*; U37 2(NC); U38 43(LDO_O)

### Notes on the sheet
- Strapping Pins
- Strapping Pin
- Single LED Mode
- LED MODE
- Pin
- Description
- LED2
- 1 :  Link off
- 0 :  Link on (any speed), solid color
- LED1
- Blinking :  Activity (RX, TX)
- (near R401) MODE3
- (near R402) MODE2
- (near R403) MODE1
- (near R404) MODE0
- MODE[3:0]
- 0000
- 0001
- reserved
- 1001
- 1000
- 0010
- 0011
- 1010
- 1011
- 0100
- 0101
- 0110
- NAND Tree mode
- 1101
- 1100
- 1110
- Advertise all capabilites, except 1000BT half-duplex (RGMII)
- Advertise 1000BT full-duplex only (RGMII)
- Advertise 1000BT full- and half-duplex only (RGMII)
- (near R409) CLK125_EN
  0  =  DISABLE
  1  =  ENABLE
- 0111
- Chip Power Down
- 1111
- Advertise all capabilites (RGMII)
- (near R410) PHYAD2
- (near R411) PHYAD1
- (near R412) PHYAD0
- (in symbol KSZ9031RNX_0) KSZ9031RNX / 48-pin QFN / Paddle Ground / (bottom of / chip)

### Library data of the parts
*#19 = Title_block_PPC: Schematic Page Count: 45; Schematic Page Number: 19; Page Modify Date: *
C385 = CAP NP_Dup9: COND.CER. 100NF 50V 0402 X7R SMD; Manufacturer Part Number 1: CGA2B3X7R1H104M050BD; Manufacturer 1: TDK; Part Number: PASSIVE_24; ID: C496; TECNO77: C0402; RSM: RC0402; Distributor 1: MURATA ELETTRONICA SPA; Part Type: Capacitors\Ceramic\SMD\0402; PCB Footprint: SMD_0402
C386 = CAP NP_Dup9: COND.CER. 100NF 50V 0402 X7R SMD; Manufacturer Part Number 1: CGA2B3X7R1H104M050BD; Manufacturer 1: TDK; Part Number: PASSIVE_24; ID: C497; TECNO77: C0402; RSM: RC0402; Distributor 1: MURATA ELETTRONICA SPA; Part Type: Capacitors\Ceramic\SMD\0402; PCB Footprint: SMD_0402
C387 = CAP NP_Dup9: CAP CER 27PF 50V 5% NP0 0402; Manufacturer Part Number 1: C1005C0G1H270J; Manufacturer 1: TDK; Part Number: PASSIVE_68; ID: C319; TECNO77: C0402; RSM: RC0402; Distributor 1: DIGIKEY (445-1240-1-ND); Part Type: Capacitors\Ceramic\SMD\0402; PCB Footprint: SMD_0402
C388 = CAP NP_Dup9: COND.CER.10uF 0603 25V SMD; Part Number: PASSIVE_124; Manufacturer 1: SAMSUNG; Manufacturer Part Number 1: CL10A106MA8NRNC; ID: C325; TECNO77: C0402; RSM: RC0603; Part Type: Capacitors\Ceramic\SMD\0603; Distributor 1: DIGIKEY (1276-1450-2-ND); PCB Footprint: SMD_0603
C389 = CAP NP_Dup9: COND.CER. 100NF 50V 0402 X7R SMD; Part Number: PASSIVE_24; Manufacturer 1: TDK; Manufacturer Part Number 1: CGA2B3X7R1H104M050BD; ID: C322; TECNO77: C0402; RSM: RC0402; Part Type: Capacitors\Ceramic\SMD\0402; Distributor 1: MURATA ELETTRONICA SPA; PCB Footprint: SMD_0402
C390 = CAP NP_Dup9: COND.CER. 10NF 50V 0402 X7R SMD; Manufacturer Part Number 1: C0402C103K5RACTU; Manufacturer 1: KEMET; Part Number: PASSIVE_29; ID: C323; TECNO77: C0402; RSM: RC0402; Distributor 1: TTI ITALY SRL; Part Type: Capacitors\Ceramic\SMD\0402; PCB Footprint: SMD_0402
C391 = CAP NP_Dup9: COND.CER. 100NF 50V 0402 X7R SMD; Manufacturer Part Number 1: CGA2B3X7R1H104M050BD; Manufacturer 1: TDK; Part Number: PASSIVE_24; ID: C787; TECNO77: C0402; RSM: RC0402; Distributor 1: MURATA ELETTRONICA SPA; Part Type: Capacitors\Ceramic\SMD\0402; PCB Footprint: SMD_0402
C392 = CAP NP_Dup9: CAP CER 27PF 50V 5% NP0 0402; Part Number: PASSIVE_68; Manufacturer 1: TDK; Manufacturer Part Number 1: C1005C0G1H270J; ID: C320; TECNO77: C0402; RSM: RC0402; Part Type: Capacitors\Ceramic\SMD\0402; Distributor 1: DIGIKEY (445-1240-1-ND); PCB Footprint: SMD_0402
C393 = CAP NP_Dup9: COND.CER. 100NF 50V 0402 X7R SMD; Manufacturer Part Number 1: CGA2B3X7R1H104M050BD; Manufacturer 1: TDK; Part Number: PASSIVE_24; ID: C329; TECNO77: C0402; RSM: RC0402; Distributor 1: MURATA ELETTRONICA SPA; Part Type: Capacitors\Ceramic\SMD\0402; PCB Footprint: SMD_0402
C394 = CAP NP_Dup2: COND.CER.10uF 0603 25V SMD; Part Number: PASSIVE_124; Manufacturer 1: SAMSUNG; Manufacturer Part Number 1: CL10A106MA8NRNC; RSM: RC0603; Part Type: Capacitors\Ceramic\SMD\0603; PCB Footprint: SMD_0603
C395 = CAP NP_Dup9: COND.CER. 10NF 50V 0402 X7R SMD; Manufacturer Part Number 1: C0402C103K5RACTU; Manufacturer 1: KEMET; Part Number: PASSIVE_29; ID: C331; TECNO77: C0402; RSM: RC0402; Distributor 1: TTI ITALY SRL; Part Type: Capacitors\Ceramic\SMD\0402; PCB Footprint: SMD_0402
C396 = CAP NP_Dup9: COND.CER. 10NF 50V 0402 X7R SMD; Manufacturer Part Number 1: C0402C103K5RACTU; Manufacturer 1: KEMET; Part Number: PASSIVE_29; ID: C332; TECNO77: C0402; RSM: RC0402; Distributor 1: TTI ITALY SRL; Part Type: Capacitors\Ceramic\SMD\0402; PCB Footprint: SMD_0402
C397 = CAP NP_Dup9: COND.CER. 10NF 50V 0402 X7R SMD; Manufacturer Part Number 1: C0402C103K5RACTU; Manufacturer 1: KEMET; Part Number: PASSIVE_29; ID: C333; TECNO77: C0402; RSM: RC0402; Distributor 1: TTI ITALY SRL; Part Type: Capacitors\Ceramic\SMD\0402; PCB Footprint: SMD_0402
C398 = CAP NP_Dup9: COND.CER. 100NF 50V 0402 X7R SMD; Part Number: PASSIVE_24; Manufacturer 1: TDK; Manufacturer Part Number 1: CGA2B3X7R1H104M050BD; ID: C335; TECNO77: C0402; RSM: RC0402; Part Type: Capacitors\Ceramic\SMD\0402; Distributor 1: MURATA ELETTRONICA SPA; PCB Footprint: SMD_0402
C399 = CAP NP_Dup9: COND.CER.10uF 0603 25V SMD; Manufacturer Part Number 1: CL10A106MA8NRNC; Manufacturer 1: SAMSUNG; Part Number: PASSIVE_124; ID: C336; TECNO77: C0402; RSM: RC0603; Distributor 1: DIGIKEY (1276-1450-2-ND); Part Type: Capacitors\Ceramic\SMD\0603; PCB Footprint: SMD_0603
C400 = CAP NP_Dup9: COND.CER. 10NF 50V 0402 X7R SMD; Part Number: PASSIVE_29; Manufacturer 1: KEMET; Manufacturer Part Number 1: C0402C103K5RACTU; ID: C337; TECNO77: C0402; RSM: RC0402; Part Type: Capacitors\Ceramic\SMD\0402; Distributor 1: TTI ITALY SRL; PCB Footprint: SMD_0402
C401 = CAP NP_Dup9: COND.CER. 10NF 50V 0402 X7R SMD; Manufacturer Part Number 1: C0402C103K5RACTU; Manufacturer 1: KEMET; Part Number: PASSIVE_29; ID: C338; TECNO77: C0402; RSM: RC0402; Distributor 1: TTI ITALY SRL; Part Type: Capacitors\Ceramic\SMD\0402; PCB Footprint: SMD_0402
C402 = CAP NP_Dup9: COND.CER. 10NF 50V 0402 X7R SMD; Manufacturer Part Number 1: C0402C103K5RACTU; Manufacturer 1: KEMET; Part Number: PASSIVE_29; ID: C339; TECNO77: C0402; RSM: RC0402; Distributor 1: TTI ITALY SRL; Part Type: Capacitors\Ceramic\SMD\0402; PCB Footprint: SMD_0402
C403 = CAP NP_Dup9: COND.CER. 100NF 50V 0402 X7R SMD; Part Number: PASSIVE_24; Manufacturer 1: TDK; Manufacturer Part Number 1: CGA2B3X7R1H104M050BD; ID: C340; TECNO77: C0402; RSM: RC0402; Part Type: Capacitors\Ceramic\SMD\0402; Distributor 1: MURATA ELETTRONICA SPA; PCB Footprint: SMD_0402
C404 = CAP NP_Dup9: COND.CER.10uF 0603 25V SMD; Manufacturer Part Number 1: CL10A106MA8NRNC; Manufacturer 1: SAMSUNG; Part Number: PASSIVE_124; ID: C341; TECNO77: C0402; RSM: RC0603; Distributor 1: DIGIKEY (1276-1450-2-ND); Part Type: Capacitors\Ceramic\SMD\0603; PCB Footprint: SMD_0603
C405 = CAP NP_Dup9: COND.CER. 10NF 50V 0402 X7R SMD; Manufacturer Part Number 1: C0402C103K5RACTU; Manufacturer 1: KEMET; Part Number: PASSIVE_29; ID: C342; TECNO77: C0402; RSM: RC0402; Distributor 1: TTI ITALY SRL; Part Type: Capacitors\Ceramic\SMD\0402; PCB Footprint: SMD_0402
C406 = CAP NP_Dup9: COND.CER. 10NF 50V 0402 X7R SMD; Part Number: PASSIVE_29; Manufacturer 1: KEMET; Manufacturer Part Number 1: C0402C103K5RACTU; ID: C343; TECNO77: C0402; RSM: RC0402; Part Type: Capacitors\Ceramic\SMD\0402; Distributor 1: TTI ITALY SRL; PCB Footprint: SMD_0402
C407 = CAP NP_Dup9: COND.CER. 100NF 50V 0402 X7R SMD; Part Number: PASSIVE_24; Manufacturer 1: TDK; Manufacturer Part Number 1: CGA2B3X7R1H104M050BD; ID: C344; TECNO77: C0402; RSM: RC0402; Part Type: Capacitors\Ceramic\SMD\0402; Distributor 1: MURATA ELETTRONICA SPA; PCB Footprint: SMD_0402
C408 = CAP NP_Dup9: COND.CER.10uF 0603 25V SMD; Manufacturer Part Number 1: CL10A106MA8NRNC; Manufacturer 1: SAMSUNG; Part Number: PASSIVE_124; ID: C345; TECNO77: C0402; RSM: RC0603; Distributor 1: DIGIKEY (1276-1450-2-ND); Part Type: Capacitors\Ceramic\SMD\0603; PCB Footprint: SMD_0603
C409 = CAP NP_Dup9: COND.CER. 10NF 50V 0402 X7R SMD; Manufacturer Part Number 1: C0402C103K5RACTU; Manufacturer 1: KEMET; Part Number: PASSIVE_29; ID: C346; TECNO77: C0402; RSM: RC0402; Distributor 1: TTI ITALY SRL; Part Type: Capacitors\Ceramic\SMD\0402; PCB Footprint: SMD_0402
C410 = CAP NP_Dup9: COND.CER. 100NF 50V 0402 X7R SMD; Part Number: PASSIVE_24; Manufacturer 1: TDK; Manufacturer Part Number 1: CGA2B3X7R1H104M050BD; ID: C347; TECNO77: C0402; RSM: RC0402; Part Type: Capacitors\Ceramic\SMD\0402; Distributor 1: MURATA ELETTRONICA SPA; PCB Footprint: SMD_0402
C411 = CAP NP_Dup9: COND.CER.10uF 0603 25V SMD; Manufacturer Part Number 1: CL10A106MA8NRNC; Manufacturer 1: SAMSUNG; Part Number: PASSIVE_124; ID: C348; TECNO77: C0402; RSM: RC0603; Distributor 1: DIGIKEY (1276-1450-2-ND); Part Type: Capacitors\Ceramic\SMD\0603; PCB Footprint: SMD_0603
C412 = CAP NP_Dup9: COND.CER. 10NF 50V 0402 X7R SMD; Manufacturer Part Number 1: C0402C103K5RACTU; Manufacturer 1: KEMET; Part Number: PASSIVE_29; ID: C349; TECNO77: C0402; RSM: RC0402; Distributor 1: TTI ITALY SRL; Part Type: Capacitors\Ceramic\SMD\0402; PCB Footprint: SMD_0402
C413 = CAP NP_Dup9: COND.CER. 10NF 50V 0402 X7R SMD; Part Number: PASSIVE_29; Manufacturer 1: KEMET; Manufacturer Part Number 1: C0402C103K5RACTU; ID: C350; TECNO77: C0402; RSM: RC0402; Part Type: Capacitors\Ceramic\SMD\0402; Distributor 1: TTI ITALY SRL; PCB Footprint: SMD_0402
C414 = CAP NP_Dup9: COND.CER. 10NF 50V 0402 X7R SMD; Manufacturer Part Number 1: C0402C103K5RACTU; Manufacturer 1: KEMET; Part Number: PASSIVE_29; ID: C351; TECNO77: C0402; RSM: RC0402; Distributor 1: TTI ITALY SRL; Part Type: Capacitors\Ceramic\SMD\0402; PCB Footprint: SMD_0402
C415 = CAP NP_Dup9: COND.CER. 10NF 50V 0402 X7R SMD; Manufacturer Part Number 1: C0402C103K5RACTU; Manufacturer 1: KEMET; Part Number: PASSIVE_29; ID: C352; TECNO77: C0402; RSM: RC0402; Distributor 1: TTI ITALY SRL; Part Type: Capacitors\Ceramic\SMD\0402; PCB Footprint: SMD_0402
C416 = CAP NP_Dup9: COND.CER. 10NF 50V 0402 X7R SMD; Manufacturer Part Number 1: C0402C103K5RACTU; Manufacturer 1: KEMET; Part Number: PASSIVE_29; ID: C353; TECNO77: C0402; RSM: RC0402; Distributor 1: TTI ITALY SRL; Part Type: Capacitors\Ceramic\SMD\0402; PCB Footprint: SMD_0402
C417 = CAP NP_Dup9: COND.CER. 10NF 50V 0402 X7R SMD; Part Number: PASSIVE_29; Manufacturer 1: KEMET; Manufacturer Part Number 1: C0402C103K5RACTU; ID: C354; TECNO77: C0402; RSM: RC0402; Part Type: Capacitors\Ceramic\SMD\0402; Distributor 1: TTI ITALY SRL; PCB Footprint: SMD_0402
D5 = diode_schottky_SOT23_Dup1: DIODE SCHOTTKY 30V 200MA SOT-23; Part Number: DISCRETE_84; Manufacturer 1: ZETEX; TECNO77: SOT23_P321; ID: D19; Part Type: Diodes\SCHOTTKY; Manufacturer Part Number 1: BAT54; Distributor 1: FARNELL (1467516); PCB Footprint: SOT-23; RSM: SOT-23
D6 = diode_schottky_SOT23_Dup1: DIODE SCHOTTKY 30V 200MA SOT-23; Part Number: DISCRETE_84; Manufacturer 1: ZETEX; TECNO77: SOT23_P321; ID: D20; Part Type: Diodes\SCHOTTKY; Manufacturer Part Number 1: BAT54; Distributor 1: FARNELL (1467516); PCB Footprint: SOT-23; RSM: SOT-23
L11 = FERRITE_BEAD_Dup2: FERRITE CHIP 10 OHM 600MA 0805; Manufacturer 1: TDK; Part Number: PASSIVE_397; TECNO77: L0805; ID: L24; RSM: RC0805; Distributor 1: DIGIKEY (445-6180-1-ND); Manufacturer Part Number 1: HF70ACB201209-T; Part Type: Ferrite Beads\SMD\0805; PCB Footprint: SMD_0805
L12 = FERRITE_BEAD_Dup2: FERRITE CHIP 10 OHM 600MA 0805; Manufacturer 1: TDK; Part Number: PASSIVE_397; TECNO77: L0805; ID: L25; RSM: RC0805; Distributor 1: DIGIKEY (445-6180-1-ND); Manufacturer Part Number 1: HF70ACB201209-T; Part Type: Ferrite Beads\SMD\0805; PCB Footprint: SMD_0805
L13 = FERRITE_BEAD_Dup2: FERRITE CHIP 10 OHM 600MA 0805; Manufacturer 1: TDK; Part Number: PASSIVE_397; TECNO77: L0805; ID: L27; RSM: RC0805; Distributor 1: DIGIKEY (445-6180-1-ND); Manufacturer Part Number 1: HF70ACB201209-T; Part Type: Ferrite Beads\SMD\0805; PCB Footprint: SMD_0805
L14 = FERRITE_BEAD_Dup2: FERRITE CHIP 10 OHM 600MA 0805; Manufacturer 1: TDK; Part Number: PASSIVE_397; TECNO77: L0805; ID: L29; RSM: RC0805; Distributor 1: DIGIKEY (445-6180-1-ND); Manufacturer Part Number 1: HF70ACB201209-T; Part Type: Ferrite Beads\SMD\0805; PCB Footprint: SMD_0805
L15 = FERRITE_BEAD_Dup2: FERRITE CHIP 10 OHM 600MA 0805; Manufacturer 1: TDK; Part Number: PASSIVE_397; TECNO77: L0805; ID: L31; RSM: RC0805; Distributor 1: DIGIKEY (445-6180-1-ND); Manufacturer Part Number 1: HF70ACB201209-T; Part Type: Ferrite Beads\SMD\0805; PCB Footprint: SMD_0805
M10 = NMOS_SOT23_Dup1: FDV301N N CHANNEL DIGITAL FET; Manufacturer Part Number 1: FDV301N  (ROHS COMPLIANT); Manufacturer 1: FAIRCHILD; Part Number: DISCRETE_196; TECNO77: SOT23_P321; ID: M23; RSM: SOT-23; Distributor 1: CLAITRON LASI SILVESTAR S.R.L; Part Type: Mosfet\SOT23; PCB Footprint: sot23
M11 = NMOS_SOT23_Dup1: FDV301N N CHANNEL DIGITAL FET; Part Number: DISCRETE_196; Manufacturer 1: FAIRCHILD; Manufacturer Part Number 1: FDV301N  (ROHS COMPLIANT); TECNO77: SOT23_P321; ID: M24; RSM: SOT-23; Part Type: Mosfet\SOT23; Distributor 1: CLAITRON LASI SILVESTAR S.R.L; PCB Footprint: sot23
R381 = R_Dup8: RESIS.CHIP 22R 5% 0402 SMD; Manufacturer 1: ROYAL OHM; Part Number: PASSIVE_840; ID: R293; TECNO77: R0402; RSM: RC0402; Distributor 1: CAMEL ELETTRONICA SRL  #; Manufacturer Part Number 1: RESIS.CHIP 22R 5% 0402 SMD; Part Type: Resistors\Fixed\SMD\0402\5%; PCB Footprint: SMD_0402
R382 R385 R396-R400 R405-R408 = R_Dup5: RESIS.CHIP 10K 1% 0402 SMD; Part Number: PASSIVE_584; Manufacturer 1: ROYAL OHM; RSM: RC0402; Part Type: Resistors\Fixed\SMD\0402\1%; PCB Footprint: SMD_0402; Manufacturer Part Number 1: RESIS.CHIP 10K 1% 0402 SMD
R383 = R_Dup8: RESIS.CHIP 0R 5% 0402 SMD; Manufacturer 1: ROYAL OHM; Part Number: PASSIVE_805; ID: R298; TECNO77: R0402; RSM: RC0402; Distributor 1: CAMEL ELETTRONICA SRL  #; Manufacturer Part Number 1: RESIS.CHIP 0R 5% 0402 SMD; Part Type: Resistors\Fixed\SMD\0402\5%; PCB Footprint: SMD_0402
R384 = R_Dup8: RESIS.CHIP 0R 5% 0402 SMD; Manufacturer 1: ROYAL OHM; Part Number: PASSIVE_805; ID: R296; TECNO77: R0402; RSM: RC0402; Distributor 1: CAMEL ELETTRONICA SRL  #; Manufacturer Part Number 1: RESIS.CHIP 0R 5% 0402 SMD; Part Type: Resistors\Fixed\SMD\0402\5%; PCB Footprint: SMD_0402
R386 = R_Dup8: RESIS.CHIP 0R 5% 0402 SMD; Manufacturer 1: ROYAL OHM; Part Number: PASSIVE_805; TECNO77: R0402; ID: R301; RSM: RC0402; Distributor 1: CAMEL ELETTRONICA SRL  #; Manufacturer Part Number 1: RESIS.CHIP 0R 5% 0402 SMD; Part Type: Resistors\Fixed\SMD\0402\5%; PCB Footprint: SMD_0402
R387 = R_Dup8: RESIS.CHIP 12,1K 1% 0402 SMD; Manufacturer 1: ROYAL OHM; Part Number: PASSIVE_590; ID: R299; TECNO77: R0402; RSM: RC0402; Distributor 1: CAMEL ELETTRONICA SRL  #; Manufacturer Part Number 1: RESIS.CHIP 12,1K 1% 0402 SMD; Part Type: Resistors\Fixed\SMD\0402\1%; PCB Footprint: SMD_0402
R388 = R_Dup8: RESIS.CHIP 22R 5% 0402 SMD; Manufacturer 1: ROYAL OHM; Part Number: PASSIVE_840; ID: R304; TECNO77: R0402; RSM: RC0402; Distributor 1: CAMEL ELETTRONICA SRL  #; Manufacturer Part Number 1: RESIS.CHIP 22R 5% 0402 SMD; Part Type: Resistors\Fixed\SMD\0402\5%; PCB Footprint: SMD_0402
R389 = R_Dup8: RESIS.CHIP 22R 5% 0402 SMD; Part Number: PASSIVE_840; Manufacturer 1: ROYAL OHM; TECNO77: R0402; ID: R305; RSM: RC0402; Part Type: Resistors\Fixed\SMD\0402\5%; Manufacturer Part Number 1: RESIS.CHIP 22R 5% 0402 SMD; Distributor 1: CAMEL ELETTRONICA SRL  #; PCB Footprint: SMD_0402
R390 = R_Dup8: RESIS.CHIP 22R 5% 0402 SMD; Part Number: PASSIVE_840; Manufacturer 1: ROYAL OHM; TECNO77: R0402; ID: R306; RSM: RC0402; Part Type: Resistors\Fixed\SMD\0402\5%; Manufacturer Part Number 1: RESIS.CHIP 22R 5% 0402 SMD; Distributor 1: CAMEL ELETTRONICA SRL  #; PCB Footprint: SMD_0402
R391 = R_Dup8: RESIS.CHIP 22R 5% 0402 SMD; Manufacturer 1: ROYAL OHM; Part Number: PASSIVE_840; TECNO77: R0402; ID: R307; RSM: RC0402; Distributor 1: CAMEL ELETTRONICA SRL  #; Manufacturer Part Number 1: RESIS.CHIP 22R 5% 0402 SMD; Part Type: Resistors\Fixed\SMD\0402\5%; PCB Footprint: SMD_0402
R392 = R_Dup8: RESIS.CHIP 22R 5% 0402 SMD; Manufacturer 1: ROYAL OHM; Part Number: PASSIVE_840; ID: R309; TECNO77: R0402; RSM: RC0402; Distributor 1: CAMEL ELETTRONICA SRL  #; Manufacturer Part Number 1: RESIS.CHIP 22R 5% 0402 SMD; Part Type: Resistors\Fixed\SMD\0402\5%; PCB Footprint: SMD_0402
R393 = R_Dup8: RESIS.CHIP 22R 5% 0402 SMD; Manufacturer 1: ROYAL OHM; Part Number: PASSIVE_840; TECNO77: R0402; ID: R308; RSM: RC0402; Distributor 1: CAMEL ELETTRONICA SRL  #; Manufacturer Part Number 1: RESIS.CHIP 22R 5% 0402 SMD; Part Type: Resistors\Fixed\SMD\0402\5%; PCB Footprint: SMD_0402
R394 = R_Dup8: RESIS.CHIP 22R 5% 0402 SMD; Manufacturer 1: ROYAL OHM; Part Number: PASSIVE_840; ID: R310; TECNO77: R0402; RSM: RC0402; Distributor 1: CAMEL ELETTRONICA SRL  #; Manufacturer Part Number 1: RESIS.CHIP 22R 5% 0402 SMD; Part Type: Resistors\Fixed\SMD\0402\5%; PCB Footprint: SMD_0402
R395 = R_Dup8: RESIS.CHIP 22R 5% 0402 SMD; Manufacturer 1: ROYAL OHM; Part Number: PASSIVE_840; ID: R311; TECNO77: R0402; RSM: RC0402; Distributor 1: CAMEL ELETTRONICA SRL  #; Manufacturer Part Number 1: RESIS.CHIP 22R 5% 0402 SMD; Part Type: Resistors\Fixed\SMD\0402\5%; PCB Footprint: SMD_0402
R401-R404 R409-R412 = R_Dup5: RESIS.CHIP 1K 1% 0402 SMD; Part Number: PASSIVE_628; Manufacturer 1: ROYAL OHM; RSM: RC0402; Part Type: Resistors\Fixed\SMD\0402\1%; PCB Footprint: SMD_0402; Manufacturer Part Number 1: RESIS.CHIP 1K 1% 0402 SMD
U36 = NLSV1T34: IC XLATOR 1BIT NON-INV 6ULLGA; Part Number: LOGIC_253; Manufacturer 1: ON Semi; TECNO77: LLGA6-1.45X1; ID: U59; RSM: ULLGA-6-1_45X1; CLASS: IC; PCB Footprint: 6-XFLGA; Part Type: TRANSLATOR; Manufacturer Part Number 1: NLSV1T34AMX1TCG; Distributor 1: DIGIKEY (NLSV1T34AMX1TCGOSTR-ND)
U37 = TPS720XX: IC REG LDO 1.2V 0.35A 6SON; Part Number: LINEAR_129; Manufacturer 1: TEXAS; RSM: WSON-6-2_1X2_1; Instance: ?; Part Type: Regulators\LDO; PCB Footprint: 6SON; Manufacturer Part Number 1: TPS72012DRVT; Distributor 1: DIGIKEY (296-25807-2-ND)
U38 = KSZ9031RNX_0: Gigabit Ethernet Transceiver with RGMII, WOL; Part Number: LOGIC_86; Manufacturer 1: Micrel; RSM: QFN-48-EP; PCB Footprint: QFN48; Part Type: ETHERNET\GIGABIT; Manufacturer Part Number 1: KSZ9031RNXCA; Distributor 1: MOUSER(998-KSZ9031RNXCA)
Y3 = CRYSTAL_4P_Dup3: CRYSTAL 25.000 MHZ 20PF SMD; Manufacturer Part Number 1: ECS-250-20-30B-TR (ROHS COMPLIANT); Manufacturer 1: ECS; Part Number: MISC_166; ID: Y3; TECNO77: OSC4P3.8(5X3.2)-SMT; RSM: XC-CSX2; PCB Footprint: SMD_5.0x3.2; Distributor 1: DIGIKEY (XC1124CT-ND); Part Type: Quartz

## Sheet 15_ETHERNET_CONN.SchDoc
size 297 x 209 mm
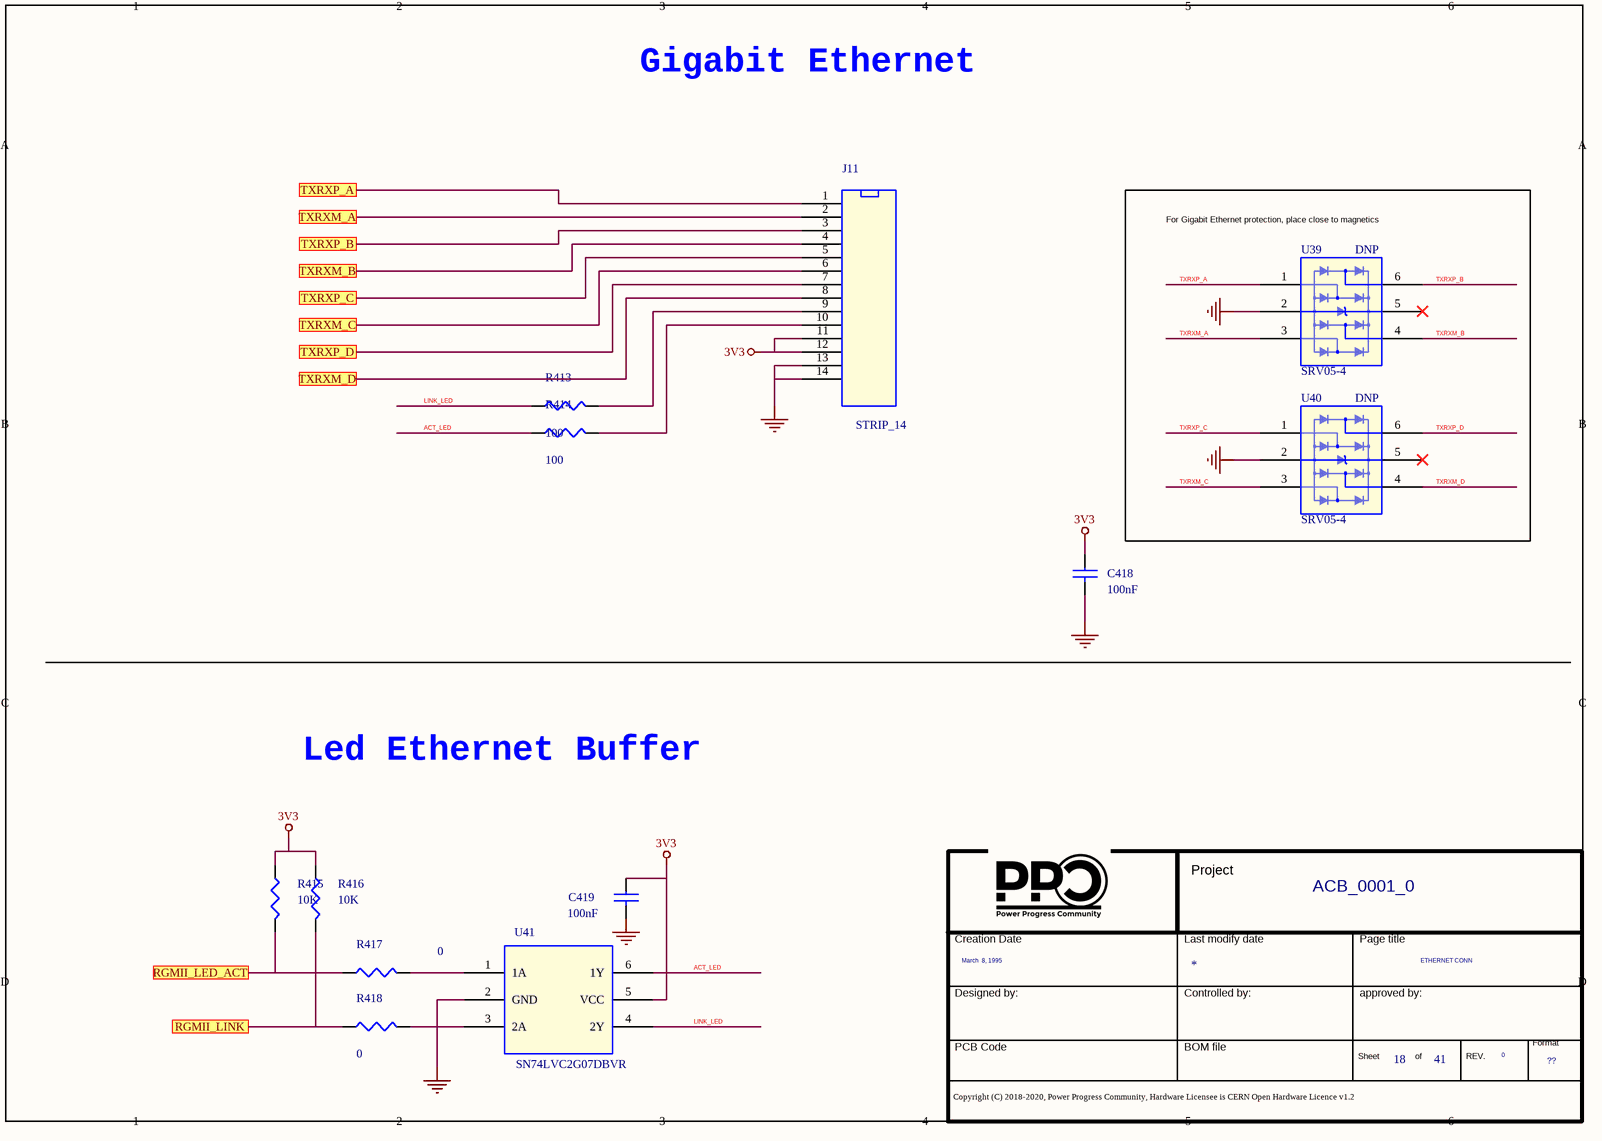
[diagram p30: 15_ETHERNET_CONN.SchDoc]

### Parts
(Parts that share a designator on the sheet are numbered #1, #2 ... from top to bottom, then left to right.)
*#20  Page Count: 41  Page Create Date: March  8, 1995  Page Number: 18  Page Size: ??  Page Title: ETHERNET CONN  RevCode: 0  Title: ACB_0001_0  (hidden comment: Title_block_PPC)  (graphical)
C418  100nF  [SMD_0402]
C419  100nF  [SMD_0402]
J11  STRIP_14  [SMD_2X50_P=0.635mm]
R413  100  [SMD_0402]
R414  100  [SMD_0402]
R415  10K  [SMD_0402]
R416  10K  [SMD_0402]
R417  0  [SMD_0402]
R418  0  [SMD_0402]
U39  SRV05-4  BOM_IGNORE: DNP  [SOT23_6]
U40  SRV05-4  BOM_IGNORE: DNP  [SOT23_6]
U41  SN74LVC2G07DBVR  [ 	SOT-26]

### Blocks framed on the sheet
For Gigabit Ethernet protection, place close to magnetics: U39 U40

### Ports
RGMII_LED_ACT, RGMII_LINK, TXRXM_A, TXRXM_B, TXRXM_C, TXRXM_D, TXRXP_A, TXRXP_B, TXRXP_C, TXRXP_D

### Nets
3V3: C418.1 C419.1 J11.11 J11.12 R415.1 R416.1 U41.5(VCC)
GND: C418.2 C419.2 J11.13 J11.14 U39.2 U40.2 U41.2(GND)
ACT_LED: R414.1 U41.6(1Y)
LINK_LED: R413.1 U41.4(2Y)
RGMII_LED_ACT: R415.2 R417.2 ; port RGMII_LED_ACT
RGMII_LINK: R416.2 R418.2 ; port RGMII_LINK
TXRXM_A: J11.2 ; port TXRXM_A
TXRXM_A: U39.3  [a separate net that carries the same name]
TXRXM_B: J11.4 ; port TXRXM_B
TXRXM_B: U39.4  [a separate net that carries the same name]
TXRXM_C: J11.6 ; port TXRXM_C
TXRXM_C: U40.3  [a separate net that carries the same name]
TXRXM_D: J11.8 ; port TXRXM_D
TXRXM_D: U40.4  [a separate net that carries the same name]
TXRXP_A: J11.1 ; port TXRXP_A
TXRXP_A: U39.1  [a separate net that carries the same name]
TXRXP_B: J11.3 ; port TXRXP_B
TXRXP_B: U39.6  [a separate net that carries the same name]
TXRXP_C: J11.5 ; port TXRXP_C
TXRXP_C: U40.1  [a separate net that carries the same name]
TXRXP_D: J11.7 ; port TXRXP_D
TXRXP_D: U40.6  [a separate net that carries the same name]
NetJ11_9: J11.9 R413.2
NetJ11_10: J11.10 R414.2
NetR417_1: R417.1 U41.1(1A)
NetR418_1: R418.1 U41.3(2A)

Not connected (* = marked no-connect by the designer): U39 5*; U40 5*

### Notes on the sheet
- Gigabit Ethernet
- Led Ethernet Buffer

### Library data of the parts
*#20 = Title_block_PPC: Schematic Page Count: 45; Schematic Page Number: 20; Page Modify Date: *
C418 = CAP NP_Dup9: COND.CER. 100NF 50V 0402 X7R SMD; LNK_PART: C0402X55; Manufacturer Part Number 1: CGA2B3X7R1H104M050BD; Manufacturer 1: TDK; Part Number: PASSIVE_24; ID: C1410; TECNO77: C0402; RSM: RC0402; PCB Footprint: SMD_0402; Distributor 1: MURATA ELETTRONICA SPA; Part Type: Capacitors\Ceramic\SMD\0402
C419 = CAP NP_Dup9: COND.CER. 100NF 50V 0402 X7R SMD; Part Number: PASSIVE_24; Manufacturer 1: TDK; Manufacturer Part Number 1: CGA2B3X7R1H104M050BD; LNK_PART: C0402X55; TECNO77: C0402; ID: C1411; RSM: RC0402; PCB Footprint: SMD_0402; Part Type: Capacitors\Ceramic\SMD\0402; Distributor 1: MURATA ELETTRONICA SPA
J11 = HEADER_14X1: STRIP MASCH 1X14P p=2.54mm PTH; PART NUMBER: CONNECTORS_497; Manufacturer 1: MOLEX; Manufacturer Part Number 1: 0022284143; RSM: PIN-100MLS-14; PCB Footprint: PTH; Part Type: Strip\Terminal; Distributor 1: DIGIKEY(WM50016-14-ND)
R413 R414 = R_Dup5: RESIS.CHIP 100R 5% 0402 SMD; Part Number: PASSIVE_812; Manufacturer 1: ROYAL OHM; RSM: RC0402; Part Type: Resistors\Fixed\SMD\0402\5%; PCB Footprint: SMD_0402; Manufacturer Part Number 1: RESIS.CHIP 100R 5% 0402 SMD
R415 R416 = R_Dup5: as R382 on sheet 14 EC1 PHY; Part Type: Resistors\Fixed\SMD\0402\1%; PCB Footprint: SMD_0402; Manufacturer Part Number 1: RESIS.CHIP 10K 1% 0402 SMD
R417 = R_Dup8: RESIS.CHIP 0R 5% 0402 SMD; LNK_PART: R0402X55; Part Number: PASSIVE_805; Manufacturer 1: ROYAL OHM; ID: R2155; TECNO77: R0402; RSM: RC0402; PCB Footprint: SMD_0402; Part Type: Resistors\Fixed\SMD\0402\5%; Manufacturer Part Number 1: RESIS.CHIP 0R 5% 0402 SMD; Distributor 1: CAMEL ELETTRONICA SRL  #
R418 = R_Dup8: RESIS.CHIP 0R 5% 0402 SMD; LNK_PART: R0402X55; Part Number: PASSIVE_805; Manufacturer 1: ROYAL OHM; ID: R2156; TECNO77: R0402; RSM: RC0402; PCB Footprint: SMD_0402; Part Type: Resistors\Fixed\SMD\0402\5%; Manufacturer Part Number 1: RESIS.CHIP 0R 5% 0402 SMD; Distributor 1: CAMEL ELETTRONICA SRL  #
U39 U40 = SRV05-4_Dup1: TVS Diode Array5VWM 17.5VC USB; Manufacturer Part Number 1: SRV05-4.TCT; Manufacturer 1: Semtec; Part Number: DISCRETE_246; PCB Footprint: SOT23-6; Vendor: Semtech; RSM: SOT-23-6; Distributor 1: DIGIKEY (SRV05-4CT-ND); Part Type: Protections; MPN: SRV05-4.TCT; TYPE: IC
U41 = SN74LVC2G07DBVR: Buffer e line driver Dual w/ Open-Drain; Part Number: LOGIC_135; Manufacturer 1: TEXAS; PCB Footprint: SOT-26; TECNO77: SOT23-6; ID: U133; RSM: SOT-23-6; Part Type: LVC\DOUBLE GATE; Manufacturer Part Number 1: SN74LVC2G07DBVR; Distributor 1: MOUSER(595-SN74LVC2G07DBVR); LNK_PART: SN74LVC2G07DBVR

## Sheet 16B Sata Connectors.SchDoc
size 420 x 297 mm
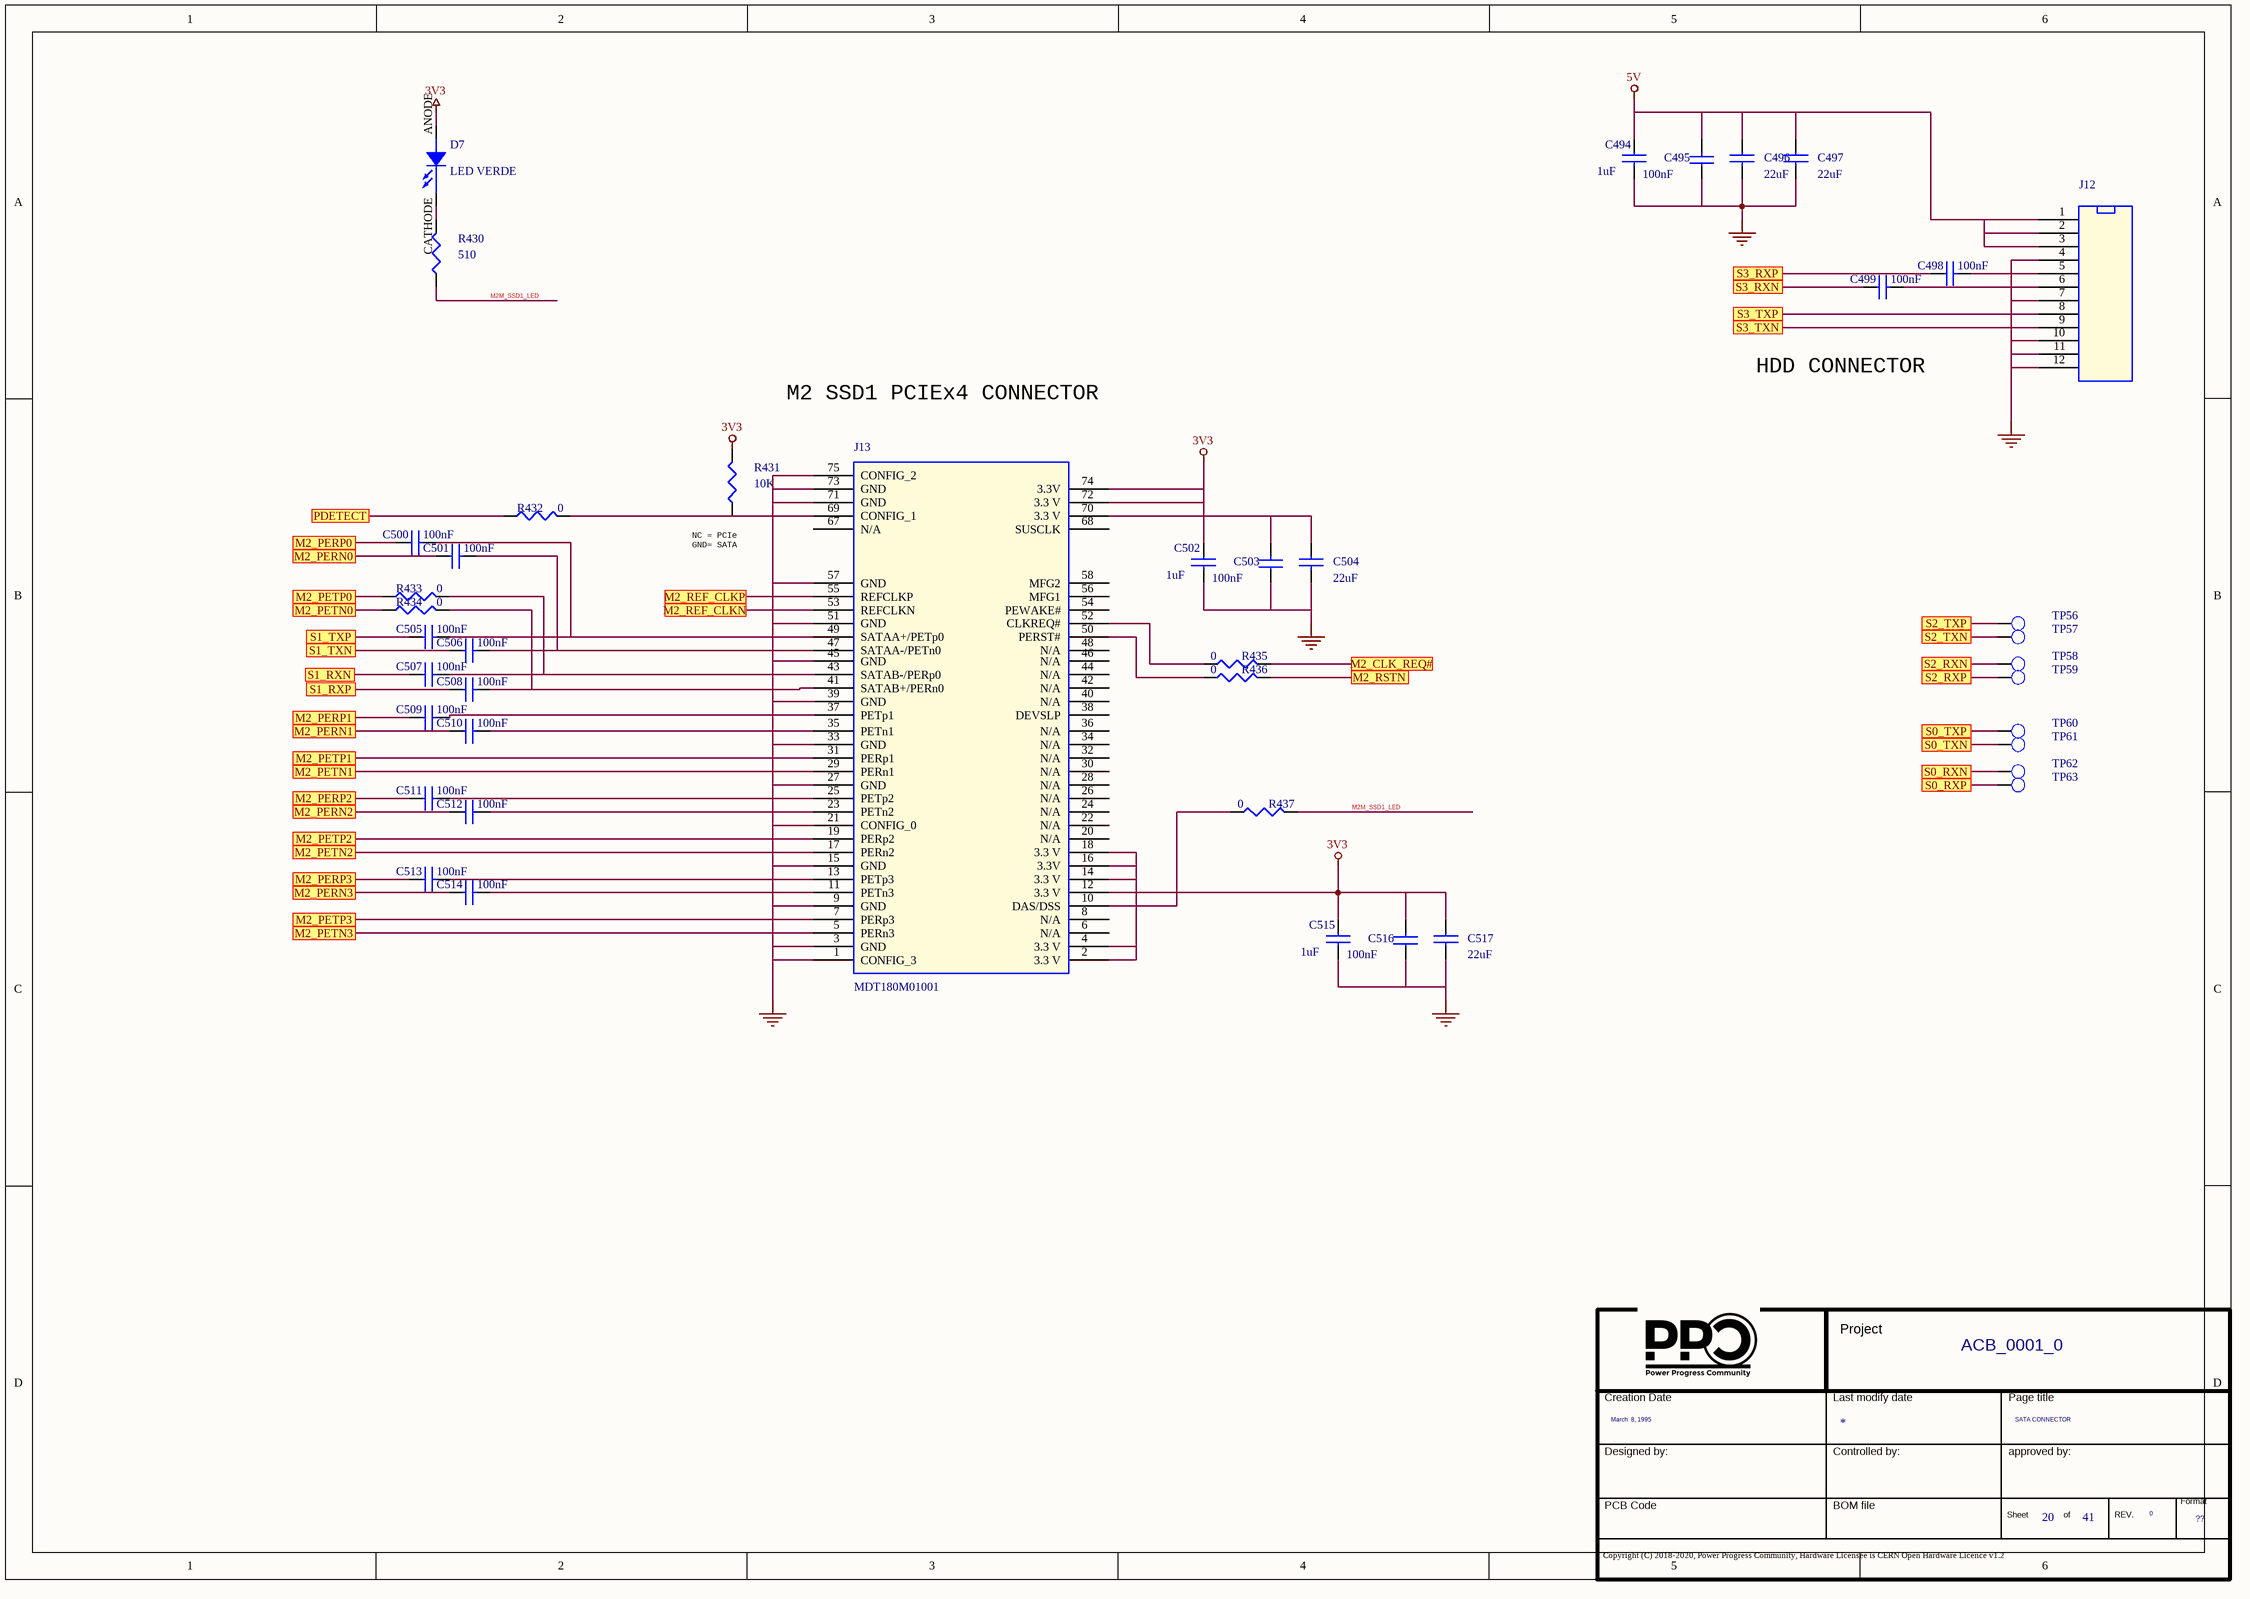
[diagram p31: 16B Sata Connectors.SchDoc]

### Parts
(Parts that share a designator on the sheet are numbered #1, #2 ... from top to bottom, then left to right.)
*#21  Page Count: 41  Page Create Date: March  8, 1995  Page Number: 20  Page Size: ??  Page Title: SATA CONNECTOR  RevCode: 0  Title: ACB_0001_0  (hidden comment: Title_block_PPC)  (graphical)
C494  1uF  [SMD_0402]
C495  100nF  [SMD_0402]
C496  22uF  [SMD_0805]
C497  22uF  [SMD_0805]
C498  100nF  [SMD_0402]
C499  100nF  [SMD_0402]
C500  100nF  [SMD_0402]
C501  100nF  [SMD_0402]
C502  1uF  [SMD_0402]
C503  100nF  [SMD_0402]
C504  22uF  [SMD_0805]
C505  100nF  [SMD_0402]
C506  100nF  [SMD_0402]
C507  100nF  [SMD_0402]
C508  100nF  [SMD_0402]
C509  100nF  [SMD_0402]
C510  100nF  [SMD_0402]
C511  100nF  [SMD_0402]
C512  100nF  [SMD_0402]
C513  100nF  [SMD_0402]
C514  100nF  [SMD_0402]
C515  1uF  [SMD_0402]
C516  100nF  [SMD_0402]
C517  22uF  [SMD_0805]
D7  LED VERDE  [led_0603]
J12  MCV 1,5/12-G-3,5  [SMD_2X50_P=0.635mm]  (value not drawn)
J13  MDT180M01001  [67 PIN PASSO 0.5mm]
R430  510  [SMD_0402]
R431  10K  [SMD_0402]
R432  0  [SMD_0402]
R433  0  [SMD_0402]
R434  0  [SMD_0402]
R435  0  [SMD_0402]
R436  0  [SMD_0402]
R437  0  [SMD_0402]
TP56  TEST POINT  [PCB]  (value not drawn)
TP57  TEST POINT  [PCB]  (value not drawn)
TP58  TEST POINT  [PCB]  (value not drawn)
TP59  TEST POINT  [PCB]  (value not drawn)
TP60  TEST POINT  [PCB]  (value not drawn)
TP61  TEST POINT  [PCB]  (value not drawn)
TP62  TEST POINT  [PCB]  (value not drawn)
TP63  TEST POINT  [PCB]  (value not drawn)

### Ports
M2_CLK_REQ#, M2_PERN0, M2_PERN1, M2_PERN2, M2_PERN3, M2_PERP0, M2_PERP1, M2_PERP2, M2_PERP3, M2_PETN0, M2_PETN1, M2_PETN2, M2_PETN3, M2_PETP0, M2_PETP1, M2_PETP2, M2_PETP3, M2_REF_CLKN, M2_REF_CLKP, M2_RSTN, PDETECT, S0_RXN, S0_RXP, S0_TXN, S0_TXP, S1_RXN, S1_RXP, S1_TXN, S1_TXP, S2_RXN, S2_RXP, S2_TXN, S2_TXP, S3_RXN, S3_RXP, S3_TXN, S3_TXP

### Nets
3V3: C502.1 C503.2 C504.1 C515.1 C516.2 C517.1 D7.ANODE J13.2(3.3_V) J13.4(3.3_V) J13.12(3.3_V) J13.14(3.3_V) J13.16(3.3V) J13.18(3.3_V) J13.70(3.3_V) J13.72(3.3_V) J13.74(3.3V) R431.1
5V: C494.1 C495.2 C496.1 C497.1 J12.1 J12.2 J12.3
GND: C494.2 C495.1 C496.2 C497.2 C502.2 C503.1 C504.2 C515.2 C516.1 C517.2 J12.4 J12.7 J12.10 J12.11 J12.12 J13.1(CONFIG_3) J13.3(GND) J13.9(GND) J13.15(GND) J13.21(CONFIG_0) J13.27(GND) J13.33(GND) J13.39(GND) J13.45(GND) J13.51(GND) J13.57(GND) J13.71(GND) J13.73(GND) J13.75(CONFIG_2)
M2M_SSD1_LED: R430.1 R437.1
S0_RXN: TP62.1(TP) ; port S0_RXN
S0_RXP: TP63.1(TP) ; port S0_RXP
S0_TXN: TP61.1(TP) ; port S0_TXN
S0_TXP: TP60.1(TP) ; port S0_TXP
S1_RXN: C507.1 ; port S1_RXN
S1_RXP: C508.1 ; port S1_RXP
S1_TXN: C506.1 ; port S1_TXN
S1_TXP: C505.1 ; port S1_TXP
S2_RXN: TP58.1(TP) ; port S2_RXN
S2_RXP: TP59.1(TP) ; port S2_RXP
S2_TXN: TP57.1(TP) ; port S2_TXN
S2_TXP: TP56.1(TP) ; port S2_TXP
S3_RXN: C499.1 ; port S3_RXN
S3_RXP: C498.1 ; port S3_RXP
S3_TXN: J12.9 ; port S3_TXN
S3_TXP: J12.8 ; port S3_TXP
NetC101_2: R433.1 ; port M2_PETP0
NetC102_2: R434.1 ; port M2_PETN0
NetC103_2: J13.31(PERp1) ; port M2_PETP1
NetC104_2: J13.29(PERn1) ; port M2_PETN1
NetC105_2: J13.19(PERp2) ; port M2_PETP2
NetC106_2: J13.17(PERn2) ; port M2_PETN2
NetC107_2: J13.7(PERp3) ; port M2_PETP3
NetC108_2: J13.5(PERn3) ; port M2_PETN3
NetC498_2: C498.2 J12.5
NetC499_2: C499.2 J12.6
NetC500_1: C500.1 ; port M2_PERP0
NetC500_2: C500.2 C505.2 J13.49(SATAA+/PETp0)
NetC501_1: C501.1 ; port M2_PERN0
NetC501_2: C501.2 C506.2 J13.47(SATAA-/PETn0)
NetC507_2: C507.2 J13.43(SATAB-/PERp0) R433.2
NetC508_2: C508.2 J13.41(SATAB+/PERn0) R434.2
NetC509_1: C509.1 ; port M2_PERP1
NetC509_2: C509.2 J13.37(PETp1)
NetC510_1: C510.1 ; port M2_PERN1
NetC510_2: C510.2 J13.35(PETn1)
NetC511_1: C511.1 ; port M2_PERP2
NetC511_2: C511.2 J13.25(PETp2)
NetC512_1: C512.1 ; port M2_PERN2
NetC512_2: C512.2 J13.23(PETn2)
NetC513_1: C513.1 ; port M2_PERP3
NetC513_2: C513.2 J13.13(PETp3)
NetC514_1: C514.1 ; port M2_PERN3
NetC514_2: C514.2 J13.11(PETn3)
NetD7_CATHODE: D7.CATHODE R430.2
NetJ13_10: J13.10(DAS/DSS) R437.2
NetJ13_50: J13.50(PERST#) R436.2
NetJ13_52: J13.52(CLKREQ#) R435.2
NetJ13_53: J13.53(REFCLKN) ; port M2_REF_CLKN
NetJ13_55: J13.55(REFCLKP) ; port M2_REF_CLKP
NetJ13_69: J13.69(CONFIG_1) R431.2 R432.2
NetR285_2: R432.1 ; port PDETECT
NetR287_2: R436.1 ; port M2_RSTN
NetR435_1: R435.1 ; port M2_CLK_REQ#

Not connected (* = marked no-connect by the designer): J13 6(N/A) 8(N/A) 20(N/A) 22(N/A) 24(N/A) 26(N/A) 28(N/A) 30(N/A) 32(N/A) 34(N/A) 36(N/A) 38(DEVSLP) 40(N/A) 42(N/A) 44(N/A) 46(N/A) 48(N/A) 54(PEWAKE#) 56(MFG1) 58(MFG2) 67(N/A) 68(SUSCLK)

### Notes on the sheet
- HDD CONNECTOR
- M2 SSD1 PCIEx4 CONNECTOR
- (near R431) NC = PCIe
  GND= SATA

### Library data of the parts
*#21 = Title_block_PPC: Schematic Page Count: 45; Schematic Page Number: 22; Page Modify Date: *
C494 = CAP NP_Dup9: CAP CER 1UF 6.3V 10% X5R 0402 AUTOMOTIVE; Part Number: PASSIVE_49; Manufacturer 1: Taiyo Yuden; Manufacturer Part Number 1: JMK105BJ105KVHF; RSM: RC0402; PCB Footprint: SMD_0402; Part Type: Capacitors\Ceramic\SMD\0402; Distributor 1: DIGIKEY (587-3766-1-ND)
C495 C501 C506 C507 C510 C512 C514 = CAP NP_Dup9: COND.CER. 100NF 50V 0402 X7R SMD; Manufacturer Part Number 1: CGA2B3X7R1H104M050BD; Manufacturer 1: TDK; Part Number: PASSIVE_24; RSM: RC0402; PCB Footprint: SMD_0402; Distributor 1: MURATA ELETTRONICA SPA; Part Type: Capacitors\Ceramic\SMD\0402
C496 C497 C504 C517 = CAP NP_Dup2: 22UF 35V 20% 0805; Part Number: PASSIVE_224; Manufacturer 1: TDK; Manufacturer Part Number 1: C2012X5R1V226M125AC; RSM: RC0805; Part Type: Capacitors\Ceramic\SMD\0805; PCB Footprint: SMD_0805
C498-C500 C503 C505 C508 C509 C511 C513 C516 = CAP NP_Dup9: COND.CER. 100NF 50V 0402 X7R SMD; Part Number: PASSIVE_24; Manufacturer 1: TDK; Manufacturer Part Number 1: CGA2B3X7R1H104M050BD; RSM: RC0402; PCB Footprint: SMD_0402; Part Type: Capacitors\Ceramic\SMD\0402; Distributor 1: MURATA ELETTRONICA SPA
C502 C515 = CAP NP_Dup9: CAP CER 1UF 6.3V 10% X5R 0402 AUTOMOTIVE; Manufacturer Part Number 1: JMK105BJ105KVHF; Manufacturer 1: Taiyo Yuden; Part Number: PASSIVE_49; RSM: RC0402; Distributor 1: DIGIKEY (587-3766-1-ND); Part Type: Capacitors\Ceramic\SMD\0402; PCB Footprint: SMD_0402
D7 = LED_1: LED CHIPLED VERDE 40mcd 570nm; Manufacturer Part Number 1: 598-8070-107F; Manufacturer 1: DIALIGHT; Part Number: DISCRETE_31; PCB Footprint: SMD_0603; RSM: LED0603-AK; Distributor 1: MOUSER(645-598-8070-107F); Part Type: Diodes\LED; TYPE: LED
J12 = HEADER_12X1_Dup1: 12X1 3.5; PART NUMBER: CONNECTORS_31; Manufacturer 1: PHOENIX; RSM: PHOE-MCV-12-3_5; PCB Footprint: 12X1 3.5; Distributor 1: Samtec; Manufacturer Part Number 1: MCV 1,5/12-G-3,5; Part Type: B2W
J13 = M2_M_KEY: Connettori PCI Express/PCI 67P SMT RCPT H1.8 M Key; Manufacturer 1: AMPHENOL; Part Number: CONNECTORS_682; RSM: FCI-MDT180M01001; PCB Footprint: 67 PIN PASSO 0.5mm; Distributor 1: MOUSER(523-MDT180M01001); Manufacturer Part Number 1: MDT180M01001; Part Type: CON_M2
R430 = R_Dup5: RESIS.CHIP 510R 1% 0402 SMD; Part Number: PASSIVE_749; Manufacturer 1: ROYAL OHM; RSM: RC0402; Part Type: Resistors\Fixed\SMD\0402\1%; Manufacturer Part Number 1: RESIS.CHIP 510R 1% 0402 SMD; PCB Footprint: SMD_0402
R431 = R_Dup5: as R382 on sheet 14 EC1 PHY; Part Type: Resistors\Fixed\SMD\0402\1%; PCB Footprint: SMD_0402; Manufacturer Part Number 1: RESIS.CHIP 10K 1% 0402 SMD
R432 = R_Dup8: RESIS.CHIP 0R 5% 0402 SMD; Manufacturer 1: ROYAL OHM; Part Number: PASSIVE_805; RSM: RC0402; Distributor 1: CAMEL ELETTRONICA SRL  #; Manufacturer Part Number 1: RESIS.CHIP 0R 5% 0402 SMD; Part Type: Resistors\Fixed\SMD\0402\5%; PCB Footprint: SMD_0402
R433-R437 = R_Dup8: RESIS.CHIP 0R 5% 0402 SMD; Part Number: PASSIVE_805; Manufacturer 1: ROYAL OHM; RSM: RC0402; Part Type: Resistors\Fixed\SMD\0402\5%; Manufacturer Part Number 1: RESIS.CHIP 0R 5% 0402 SMD; Distributor 1: CAMEL ELETTRONICA SRL  #; PCB Footprint: SMD_0402
TP56-TP63 = T POINT R_Dup1: TEST POINT SU PCB; Part Number: CONNECTORS_542; RSM: AE-TESTPOINT; PCB Footprint: PCB; Part Type: Tpoint